# Altium project PPC_notebook_electrical_schematics_v0.6.PrjPcb (part 5 of 10)

## Sheet 16 SATA3 CONTROLLER.SchDoc
size 420 x 297 mm
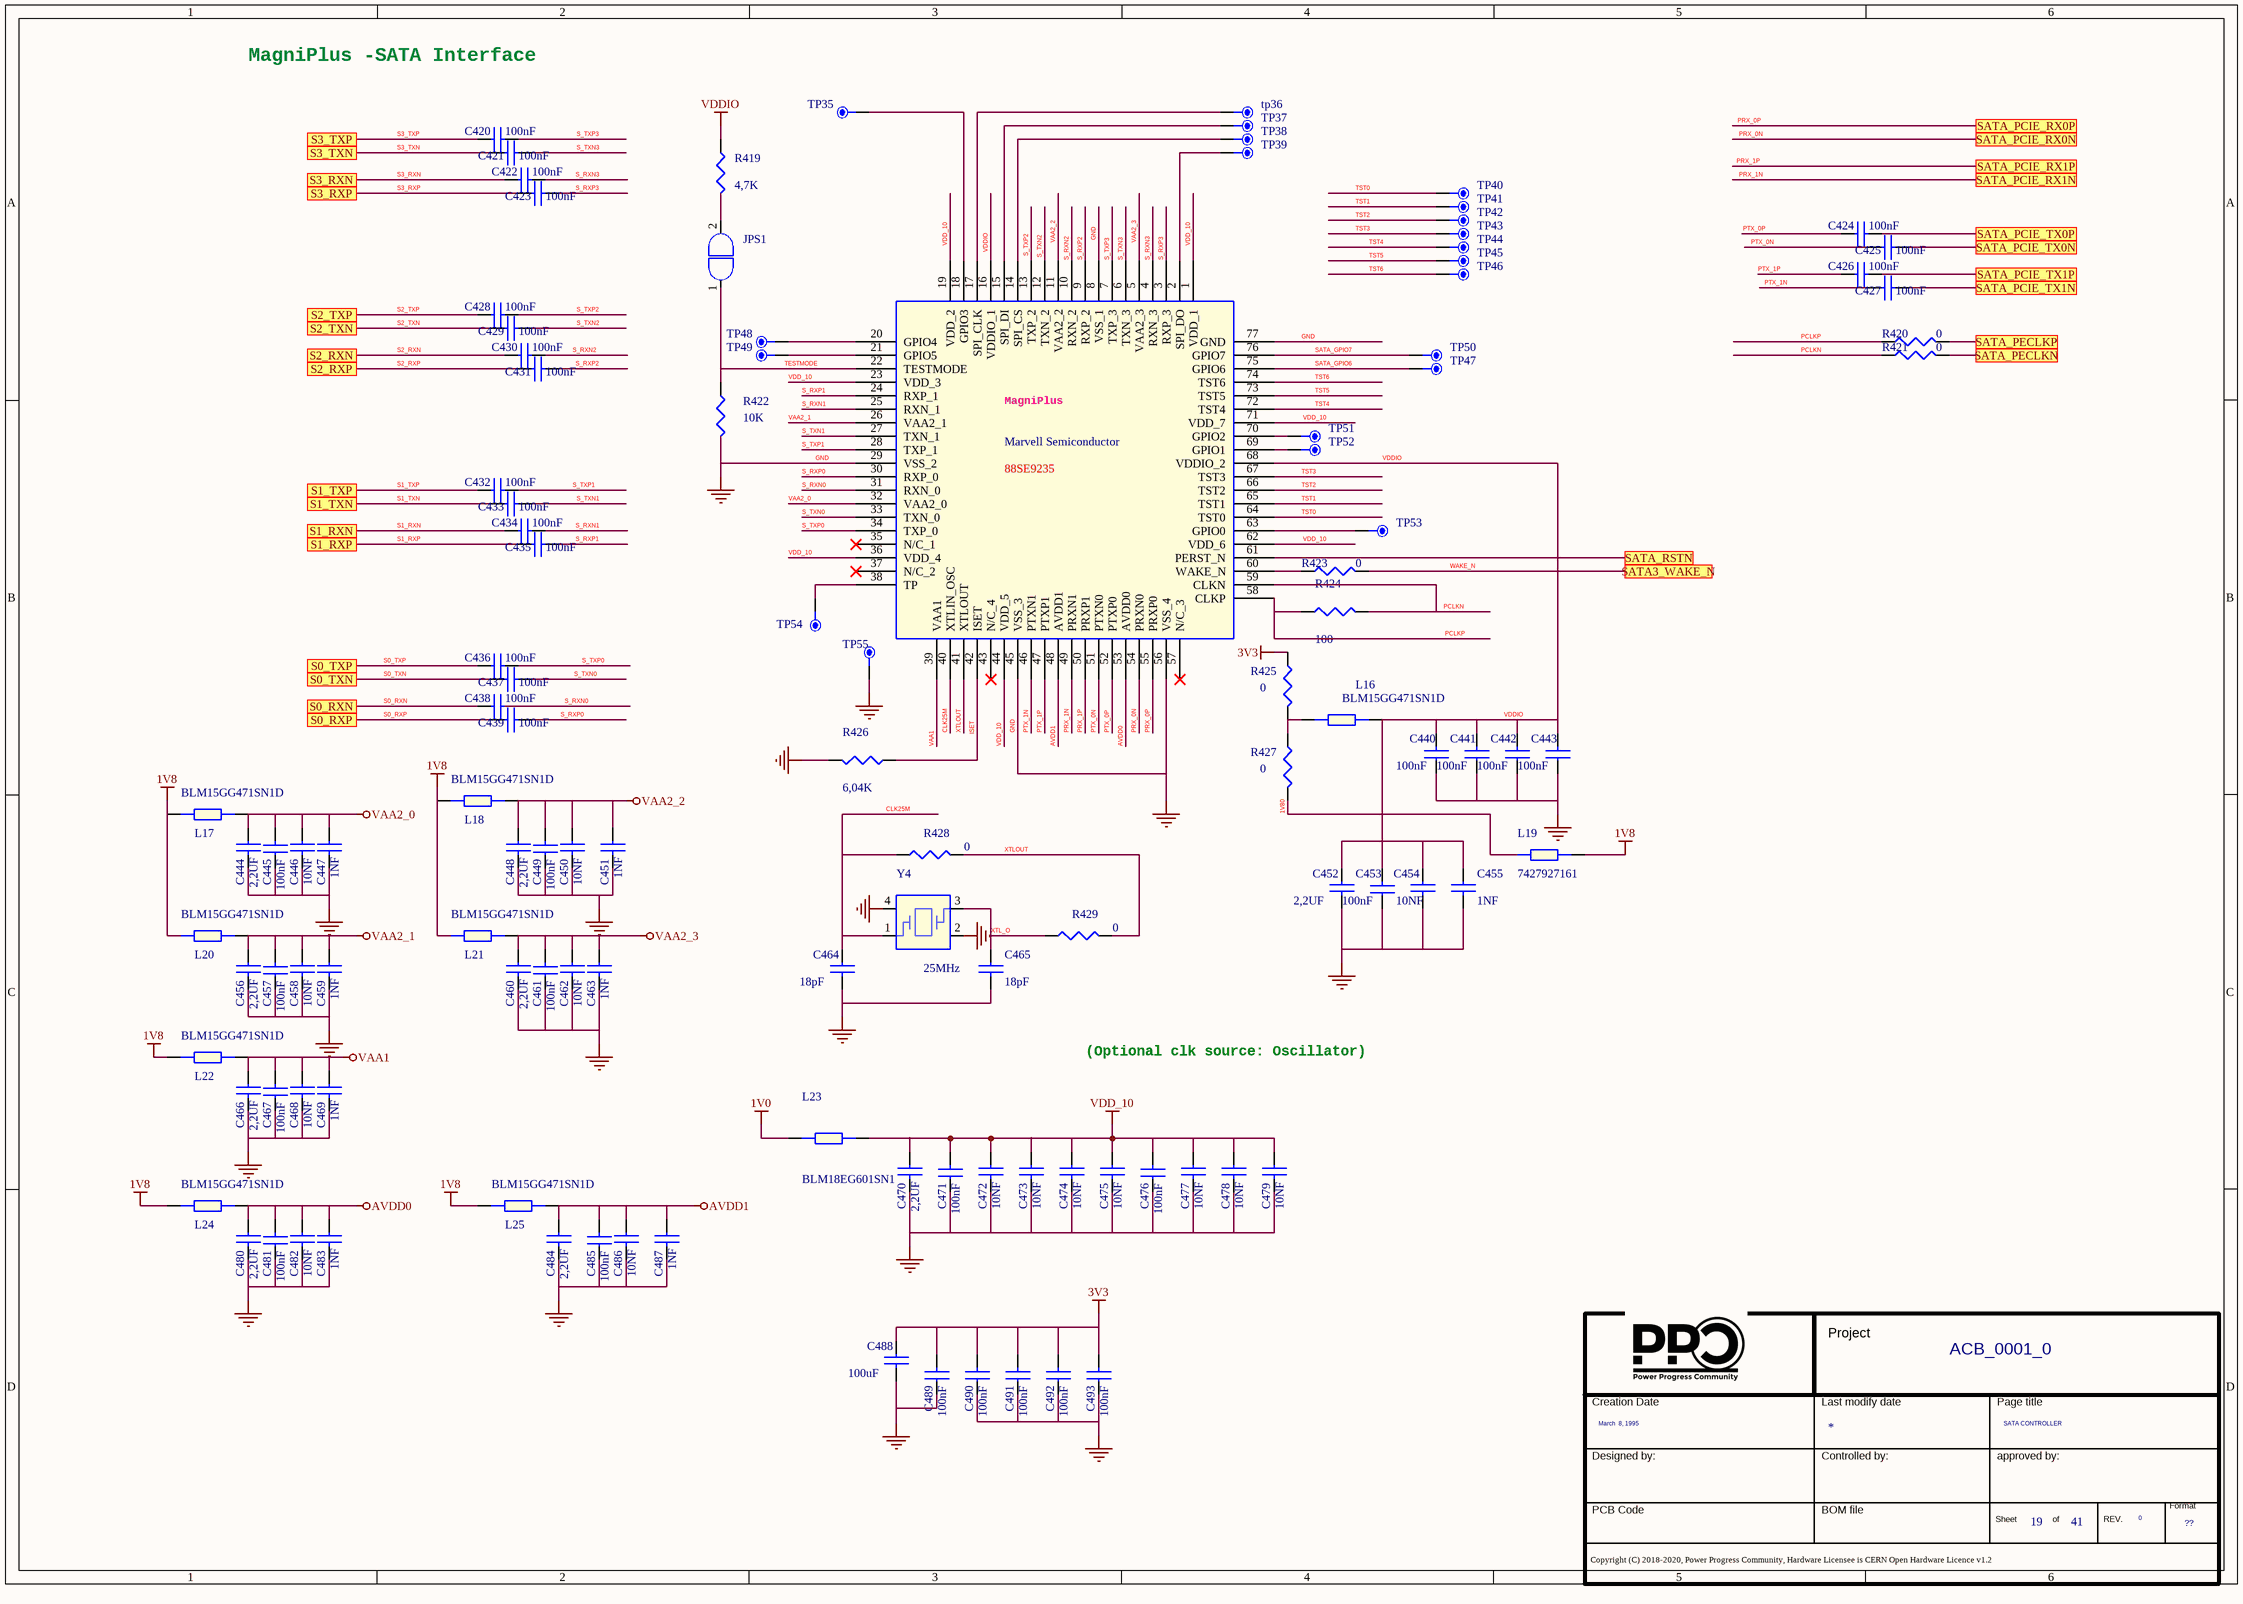
[diagram p32: 16 SATA3 CONTROLLER.SchDoc]

### Parts
(Parts that share a designator on the sheet are numbered #1, #2 ... from top to bottom, then left to right.)
*#22  Page Count: 41  Page Create Date: March  8, 1995  Page Number: 19  Page Size: ??  Page Title: SATA CONTROLLER  RevCode: 0  Title: ACB_0001_0  (hidden comment: Title_block_PPC)  (graphical)
C420  100nF  [SMD_0402]
C421  100nF  [SMD_0402]
C422  100nF  [SMD_0402]
C423  100nF  [SMD_0402]
C424  100nF  [SMD_0402]
C425  100nF  [SMD_0402]
C426  100nF  [SMD_0402]
C427  100nF  [SMD_0402]
C428  100nF  [SMD_0402]
C429  100nF  [SMD_0402]
C430  100nF  [SMD_0402]
C431  100nF  [SMD_0402]
C432  100nF  [SMD_0402]
C433  100nF  [SMD_0402]
C434  100nF  [SMD_0402]
C435  100nF  [SMD_0402]
C436  100nF  [SMD_0402]
C437  100nF  [SMD_0402]
C438  100nF  [SMD_0402]
C439  100nF  [SMD_0402]
C440  100nF  [SMD_0402]
C441  100nF  [SMD_0402]
C442  100nF  [SMD_0402]
C443  100nF  [SMD_0402]
C444  2,2UF  [SMD_0402]
C445  100nF  [SMD_0402]
C446  10NF  [SMD_0402]
C447  1NF  [SMD_0402]
C448  2,2UF  [SMD_0402]
C449  100nF  [SMD_0402]
C450  10NF  [SMD_0402]
C451  1NF  [SMD_0402]
C452  2,2UF  [SMD_0402]
C453  100nF  [SMD_0402]
C454  10NF  [SMD_0402]
C455  1NF  [SMD_0402]
C456  2,2UF  [SMD_0402]
C457  100nF  [SMD_0402]
C458  10NF  [SMD_0402]
C459  1NF  [SMD_0402]
C460  2,2UF  [SMD_0402]
C461  100nF  [SMD_0402]
C462  10NF  [SMD_0402]
C463  1NF  [SMD_0402]
C464  18pF  [SMD_0402]
C465  18pF  [SMD_0402]
C466  2,2UF  [SMD_0402]
C467  100nF  [SMD_0402]
C468  10NF  [SMD_0402]
C469  1NF  [SMD_0402]
C470  2,2UF  [SMD_0402]
C471  100nF  [SMD_0402]
C472  10NF  [SMD_0402]
C473  10NF  [SMD_0402]
C474  10NF  [SMD_0402]
C475  10NF  [SMD_0402]
C476  100nF  [SMD_0402]
C477  10NF  [SMD_0402]
C478  10NF  [SMD_0402]
C479  10NF  [SMD_0402]
C480  2,2UF  [SMD_0402]
C481  100nF  [SMD_0402]
C482  10NF  [SMD_0402]
C483  1NF  [SMD_0402]
C484  2,2UF  [SMD_0402]
C485  100nF  [SMD_0402]
C486  10NF  [SMD_0402]
C487  1NF  [SMD_0402]
C488  100uF  [SMD_0805]
C489  100nF  [SMD_0402]
C490  100nF  [SMD_0402]
C491  100nF  [SMD_0402]
C492  100nF  [SMD_0402]
C493  100nF  [SMD_0402]
JPS1  SOLDER JUMPER X 2  [PCB]  (value not drawn)
L16  BLM15GG471SN1D  [SMD_0402]
L17  BLM15GG471SN1D  [SMD_0402]
L18  BLM15GG471SN1D  [SMD_0402]
L19  7427927161  [SMD_0402]
L20  BLM15GG471SN1D  [SMD_0402]
L21  BLM15GG471SN1D  [SMD_0402]
L22  BLM15GG471SN1D  [SMD_0402]
L23  BLM18EG601SN1  [SMD_0603]
L24  BLM15GG471SN1D  [SMD_0402]
L25  BLM15GG471SN1D  [SMD_0402]
R419  4,7K  [SMD_0402]
R420  0  [SMD_0402]
R421  0  [SMD_0402]
R422  10K  [SMD_0402]
R423  0  [SMD_0402]
R424  100  [SMD_0402]
R425  0  [SMD_0402]
R426  6,04K  [SMD_0603]
R427  0  [SMD_0402]
R428  0  [SMD_0402]
R429  0  [SMD_0402]
TP35  TPS  [TPS]  (value not drawn)
tp36  TPS  [TPS]  (value not drawn)
TP37  TPS  [TPS]  (value not drawn)
TP38  TPS  [TPS]  (value not drawn)
TP39  TPS  [TPS]  (value not drawn)
TP40  TPS  [TPS]  (value not drawn)
TP41  TPS  [TPS]  (value not drawn)
TP42  TPS  [TPS]  (value not drawn)
TP43  TPS  [TPS]  (value not drawn)
TP44  TPS  [TPS]  (value not drawn)
TP45  TPS  [TPS]  (value not drawn)
TP46  TPS  [TPS]  (value not drawn)
TP47  TPS  [TPS]  (value not drawn)
TP48  TPS  [TPS]  (value not drawn)
TP49  TPS  [TPS]  (value not drawn)
TP50  TPS  [TPS]  (value not drawn)
TP51  TPS  [TPS]  (value not drawn)
TP52  TPS  [TPS]  (value not drawn)
TP53  TPS  [TPS]  (value not drawn)
TP54  TPS  [TPS]  (value not drawn)
TP55  TPS  [TPS]  (value not drawn)
U42  Distributor_Part_Number: Marvell Semiconductor  [76-pin QFN 
LBGA-196]  (hidden comment: 88SE9235)
Y4  25MHz  [SMD_5.0x3.2]

### Ports
S0_RXN, S0_RXP, S0_TXN, S0_TXP, S1_RXN, S1_RXP, S1_TXN, S1_TXP, S2_RXN, S2_RXP, S2_TXN, S2_TXP, S3_RXN, S3_RXP, S3_TXN, S3_TXP, SATA3_WAKE_N, SATA_PCIE_RX0N, SATA_PCIE_RX0P, SATA_PCIE_RX1N, SATA_PCIE_RX1P, SATA_PCIE_TX0N, SATA_PCIE_TX0P, SATA_PCIE_TX1N, SATA_PCIE_TX1P, SATA_PECLKN, SATA_PECLKP, SATA_RSTN

### Nets
1V0: L23.1
1V8: L17.1 L18.1 L19.2 L20.1 L21.1 L22.1 L24.1 L25.1
3V3: C488.1 C489.2 C490.2 C491.2 C492.2 C493.2 R425.2
AVDD0: C480.1 C481.2 C482.1 C483.1 L24.2 U42.53(AVDD0)
AVDD1: C484.1 C485.2 C486.1 C487.1 L25.2 U42.48(AVDD1)
GND: C440.1 C441.1 C442.1 C443.1 C444.2 C445.1 C446.2 C447.2 C448.2 C449.1 C450.2 C451.2 C452.2 C453.1 C454.2 C455.2 C456.2 C457.1 C458.2 C459.2 C460.2 C461.1 C462.2 C463.2 C464.2 C465.2 C466.2 C467.1 C468.2 C469.2 C470.2 C471.1 C472.2 C473.2 C474.2 C475.2 C476.1 C477.2 C478.2 C479.2 C480.2 C481.1 C482.2 C483.2 C484.2 C485.1 C486.2 C487.2 C488.2 C489.1 C490.1 C491.1 C492.1 C493.1 R422.2 R426.2 TP55.1 U42.8(VSS_1) U42.29(VSS_2) U42.45(VSS_3) U42.56(VSS_4) U42.77(GND) Y4.2 Y4.4
VAA1: C466.1 C467.2 C468.1 C469.1 L22.2 U42.39(VAA1)
VAA2_0: C444.1 C445.2 C446.1 C447.1 L17.2 U42.32(VAA2_0)
VAA2_1: C456.1 C457.2 C458.1 C459.1 L20.2 U42.26(VAA2_1)
VAA2_2: C448.1 C449.2 C450.1 C451.1 L18.2 U42.11(VAA2_2)
VAA2_3: C460.1 C461.2 C462.1 C463.1 L21.2 U42.5(VAA2_3)
VDD_10: C470.1 C471.2 C472.1 C473.1 C474.1 C475.1 C476.2 C477.1 C478.1 C479.1 L23.2 U42.1(VDD_1) U42.19(VDD_2) U42.23(VDD_3) U42.36(VDD_4) U42.44(VDD_5) U42.62(VDD_6) U42.71(VDD_7)
VDDIO: C440.2 C441.2 C442.2 C443.2 C452.1 C453.2 C454.1 C455.1 L16.1 R419.1 U42.16(VDDIO_1) U42.68(VDDIO_2)
1V80: L19.1 R427.1
CLK25M: C464.1 R428.2 U42.40(XTLIN_OSC) Y4.1
ISET: R426.1 U42.42(ISET)
PCLKN: R421.1 R424.2 U42.59(CLKN)
PCLKP: R420.1 R424.1 U42.58(CLKP)
PRX_0N: U42.54(PRXN0) ; port SATA_PCIE_RX0N
PRX_0P: U42.55(PRXP0) ; port SATA_PCIE_RX0P
PRX_1N: U42.49(PRXN1) ; port SATA_PCIE_RX1N
PRX_1P: U42.50(PRXP1) ; port SATA_PCIE_RX1P
PTX_0N: C425.1 U42.51(PTXN0)
PTX_0P: C424.1 U42.52(PTXP0)
PTX_1N: C427.1 U42.46(PTXN1)
PTX_1P: C426.1 U42.47(PTXP1)
S0_RXN: C438.1 ; port S0_RXN
S0_RXP: C439.1 ; port S0_RXP
S0_TXN: C437.1 ; port S0_TXN
S0_TXP: C436.1 ; port S0_TXP
S1_RXN: C434.1 ; port S1_RXN
S1_RXP: C435.1 ; port S1_RXP
S1_TXN: C433.1 ; port S1_TXN
S1_TXP: C432.1 ; port S1_TXP
S2_RXN: C430.1 ; port S2_RXN
S2_RXP: C431.1 ; port S2_RXP
S2_TXN: C429.1 ; port S2_TXN
S2_TXP: C428.1 ; port S2_TXP
S3_RXN: C422.1 ; port S3_RXN
S3_RXP: C423.1 ; port S3_RXP
S3_TXN: C421.1 ; port S3_TXN
S3_TXP: C420.1 ; port S3_TXP
S_RXN0: C438.2 U42.31(RXN_0)
S_RXN1: C434.2 U42.25(RXN_1)
S_RXN2: C430.2 U42.10(RXN_2)
S_RXN3: C422.2 U42.4(RXN_3)
S_RXP0: C439.2 U42.30(RXP_0)
S_RXP1: C435.2 U42.24(RXP_1)
S_RXP2: C431.2 U42.9(RXP_2)
S_RXP3: C423.2 U42.3(RXP_3)
S_TXN0: C437.2 U42.33(TXN_0)
S_TXN1: C433.2 U42.27(TXN_1)
S_TXN2: C429.2 U42.12(TXN_2)
S_TXN3: C421.2 U42.6(TXN_3)
S_TXP0: C436.2 U42.34(TXP_0)
S_TXP1: C432.2 U42.28(TXP_1)
S_TXP2: C428.2 U42.13(TXP_2)
S_TXP3: C420.2 U42.7(TXP_3)
SATA_GPIO6: TP47.1 U42.75(GPIO6)
SATA_GPIO7: TP50.1 U42.76(GPIO7)
TESTMODE: JPS1.1 R422.1 U42.22(TESTMODE)
TST0: TP40.1 U42.64(TST0)
TST1: TP41.1 U42.65(TST1)
TST2: TP42.1 U42.66(TST2)
TST3: TP43.1 U42.67(TST3)
TST4: TP44.1 U42.72(TST4)
TST5: TP45.1 U42.73(TST5)
TST6: TP46.1 U42.74(TST6)
WAKE_N: R423.2 ; port SATA3_WAKE_N
XTL_O: C465.1 R429.2 Y4.3
XTLOUT: R428.1 R429.1 U42.41(XTLOUT)
NetC109_2: C424.2 ; port SATA_PCIE_TX0P
NetC110_2: C425.2 ; port SATA_PCIE_TX0N
NetC111_2: C426.2 ; port SATA_PCIE_TX1P
NetC112_2: C427.2 ; port SATA_PCIE_TX1N
NetJPS1_2: JPS1.2 R419.2
NetL16_2: L16.2 R425.1 R427.2
NetR286_2: U42.61(PERST_N) ; port SATA_RSTN
NetR420_2: R420.2 ; port SATA_PECLKP
NetR421_2: R421.2 ; port SATA_PECLKN
NetR423_1: R423.1 U42.60(WAKE_N)
NetTP35_1: TP35.1 U42.18(GPIO3)
Nettp36_1: tp36.1 U42.17(SPI_CLK)
NetTP37_1: TP37.1 U42.15(SPI_DI)
NetTP38_1: TP38.1 U42.14(SPI_CS)
NetTP39_1: TP39.1 U42.2(SPI_DO)
NetTP48_1: TP48.1 U42.20(GPIO4)
NetTP49_1: TP49.1 U42.21(GPIO5)
NetTP51_1: TP51.1 U42.70(GPIO2)
NetTP52_1: TP52.1 U42.69(GPIO1)
NetTP53_1: TP53.1 U42.63(GPIO0)
NetTP54_1: TP54.1 U42.38(TP)

Not connected (* = marked no-connect by the designer): U42 35(N/C_1)* 37(N/C_2)* 43(N/C_4)* 57(N/C_3)*

### Notes on the sheet
- MagniPlus -SATA Interface
- (near U42) MagniPlus
- (Optional clk source: Oscillator)

### Library data of the parts
*#22 = Title_block_PPC: Schematic Page Count: 45; Schematic Page Number: 21; Page Modify Date: *
C420 C422 C425 C426 C428 C430 C432 C434 C437 C439 C449 C453 C485 = CAP NP_Dup9: as C495 on sheet 16B Sata Connectors; PCB Footprint: SMD_0402; Distributor 1: MURATA ELETTRONICA SPA; Part Type: Capacitors\Ceramic\SMD\0402
C421 C423 C424 C427 C429 C431 C433 C435 C436 C438 C440-C443 C445 C457 C461 C467 C471 C476 C481 C489-C493 = CAP NP_Dup9: as C498-C500 on sheet 16B Sata Connectors; PCB Footprint: SMD_0402; Part Type: Capacitors\Ceramic\SMD\0402; Distributor 1: MURATA ELETTRONICA SPA
C444 C452 C456 C460 C466 C480 C484 = CAP NP_Dup9: CAP CERAMIC 2.2UF 6.3V X5R 0402; Manufacturer Part Number 1: ECJ-0EB0J225M; Manufacturer 1: Panasonic - ECG; Part Number: PASSIVE_55; RSM: RC0402; PCB Footprint: SMD_0402; Distributor 1: DIGIKEY (PCC2421TR-ND); Part Type: Capacitors\Ceramic\SMD\0402
C446 C458 C462 C468 C472-C475 C477-C479 C482 = CAP NP_Dup9: COND.CER. 10NF 50V 0402 X7R SMD; Manufacturer Part Number 1: C0402C103K5RACTU; Manufacturer 1: KEMET; Part Number: PASSIVE_29; RSM: RC0402; PCB Footprint: SMD_0402; Distributor 1: TTI ITALY SRL; Part Type: Capacitors\Ceramic\SMD\0402
C447 C451 C459 C463 C469 C483 C487 = CAP NP_Dup9: COND.CER. 1NF 50V 0402 NPO SMD; Manufacturer Part Number 1: 223858715523; Manufacturer 1: YAGEO; Part Number: PASSIVE_46; RSM: RC0402; PCB Footprint: SMD_0402; Distributor 1: CLAITRON LASI SILVESTAR S.R.L.; Part Type: Capacitors\Ceramic\SMD\0402
C448 C470 = CAP NP_Dup9: CAP CERAMIC 2.2UF 6.3V X5R 0402; Part Number: PASSIVE_55; Manufacturer 1: Panasonic - ECG; Manufacturer Part Number 1: ECJ-0EB0J225M; RSM: RC0402; PCB Footprint: SMD_0402; Part Type: Capacitors\Ceramic\SMD\0402; Distributor 1: DIGIKEY (PCC2421TR-ND)
C450 C454 C486 = CAP NP_Dup9: COND.CER. 10NF 50V 0402 X7R SMD; Part Number: PASSIVE_29; Manufacturer 1: KEMET; Manufacturer Part Number 1: C0402C103K5RACTU; RSM: RC0402; PCB Footprint: SMD_0402; Part Type: Capacitors\Ceramic\SMD\0402; Distributor 1: TTI ITALY SRL
C455 = CAP NP_Dup9: COND.CER. 1NF 50V 0402 NPO SMD; Part Number: PASSIVE_46; Manufacturer 1: YAGEO; Manufacturer Part Number 1: 223858715523; RSM: RC0402; PCB Footprint: SMD_0402; Part Type: Capacitors\Ceramic\SMD\0402; Distributor 1: CLAITRON LASI SILVESTAR S.R.L.
C464 = CAP NP_Dup9: CAP CER 18PF 50V 5% NP0 0402; Part Number: PASSIVE_43; Manufacturer 1: TDK; Manufacturer Part Number 1: C1005C0G1H180J; RSM: RC0402; PCB Footprint: SMD_0402; Part Type: Capacitors\Ceramic\SMD\0402; Distributor 1: DIGIKEY (445-1238-1-ND)
C465 = CAP NP_Dup9: CAP CER 18PF 50V 5% NP0 0402; Manufacturer Part Number 1: C1005C0G1H180J; Manufacturer 1: TDK; Part Number: PASSIVE_43; RSM: RC0402; PCB Footprint: SMD_0402; Distributor 1: DIGIKEY (445-1238-1-ND); Part Type: Capacitors\Ceramic\SMD\0402
C488 = CAP NP_Dup9: CAP CER 100UF 6.3V 20% X5R 0805; Manufacturer Part Number 1: GRM21BR60J107ME15L; Manufacturer 1: Murata; Part Number: PASSIVE_202; RSM: RC0805; PCB Footprint: SMD_0805; Distributor 1: FARNELL(2494476); Part Type: Capacitors\Ceramic\SMD\0805
JPS1 = SOLDER JUMPER 2x1: SODER JUMPER SU PCB; Part Number: CONNECTORS_335; RSM: JMPS2; PCB Footprint: PCB; Part Type: SOLDER JUMPER
L16 L18 = FERRITE_BEAD_Dup1: FERRITE CHIP 470 OHM 200MA 0402; Manufacturer 1: Murata; Part Number: PASSIVE_371; RSM: RC0402; PCB Footprint: SMD_0402; Distributor 1: DIGIKEY (	490-5198-1-ND); Manufacturer Part Number 1: BLM15GG471SN1D; Part Type: Ferrite Beads\SMD\0402
L17 L20-L22 L24 L25 = FERRITE_BEAD_Dup1: FERRITE CHIP 470 OHM 200MA 0402; Part Number: PASSIVE_371; Manufacturer 1: Murata; RSM: RC0402; PCB Footprint: SMD_0402; Part Type: Ferrite Beads\SMD\0402; Manufacturer Part Number 1: BLM15GG471SN1D; Distributor 1: DIGIKEY (	490-5198-1-ND)
L19 = FERRITE_BEAD: FERRITE BEAD 600R 0.25A 0402; Part Number: PASSIVE_369; Manufacturer 1: WURTH; RSM: RC0402; PCB Footprint: SMD_0402; Part Type: Ferrite Beads\SMD\0402; Manufacturer Part Number 1: 7427927161
L23 = FERRITE_BEAD: FERRITE BEAD 600ohm 500mA 0603 SMD; Part Number: PASSIVE_377; Manufacturer 1: Murata; Manufacturer Part Number 1: BLM18EG601SN1 SMD; RSM: RC0603; Part Type: Ferrite Beads\SMD\0603; PCB Footprint: SMD_0603
R419 = R_Dup8: RESIS.CHIP 4,7K 5% 0402 SMD; Part Number: PASSIVE_861; Manufacturer 1: ROYAL OHM; RSM: RC0402; PCB Footprint: SMD_0402; Part Type: Resistors\Fixed\SMD\0402\5%; Manufacturer Part Number 1: RESIS.CHIP 4,7K 5% 0402 SMD; Distributor 1: CAMEL ELETTRONICA SRL  #
R420 R421 R423 R425 R427-R429 = R_Dup8: as R432 on sheet 16B Sata Connectors; PCB Footprint: SMD_0402; Distributor 1: CAMEL ELETTRONICA SRL  #; Manufacturer Part Number 1: RESIS.CHIP 0R 5% 0402 SMD; Part Type: Resistors\Fixed\SMD\0402\5%
R422 = R_Dup5: as R382 on sheet 14 EC1 PHY; Part Type: Resistors\Fixed\SMD\0402\1%; PCB Footprint: SMD_0402; Manufacturer Part Number 1: RESIS.CHIP 10K 1% 0402 SMD
R424 = R_Dup5: RESIS.CHIP 100R 5% 0402 SMD; Part Number: PASSIVE_812; Manufacturer 1: ROYAL OHM; RSM: RC0402; Part Type: Resistors\Fixed\SMD\0402\5%; PCB Footprint: SMD_0402; Manufacturer Part Number 1: RESIS.CHIP 100R 5% 0402 SMD
R426 = R_Dup5: RESIS.CHIP 6K04 1% 0603 SMD; Part Number: PASSIVE_1047; Manufacturer 1: ROYAL OHM; RSM: RC0603; Part Type: Resistors\Fixed\SMD\0603\1%; PCB Footprint: SMD_0603; Manufacturer Part Number 1: RESIS.CHIP 6K04 1% 0603 SMD
TP35 tp36 TP37-TP55 = TPS_2: Test Point, .025 sq pin; Mfr_Part_Number: Cut From Strip; MFR_Name: Samtec; PCB Footprint: tp36; RSM: AE-TESTPOINT; Distributor_Part_Number: no parts needed
U42 = 2020_34: Two-Lane PCIe 2.0 to Four-Port 6; MFR_Name: Marvell Semi; Mfr_Part_Number: 88SE9230; Part Number: LOGIC_356; Manufacturer 1: MARVELL; RSM: QFN-76-EP_9X9; Display Value: 88SE9235; PCB Footprint: 76-pin QFN / LBGA-196; Distributor: tbd; Part Type: PCIE\SATA; Manufacturer Part Number 1: 88SE9235; Distributor 1: MARVELL(88SE9235A1-NAA2C000)
Y4 = CRYSTAL_4P_Dup2: CRYSTAL 25.000 MHZ 20PF SMD; Part Number: MISC_166; Manufacturer 1: ECS; Manufacturer Part Number 1: ECS-250-20-30B-TR (ROHS COMPLIANT); RSM: XC-CSX2; PCB Footprint: SMD_5.0x3.2; Part Type: Quartz; Distributor 1: DIGIKEY (XC1124CT-ND)

## Sheet 17 USB3 CONTROLLER.SchDoc
size 594 x 420 mm
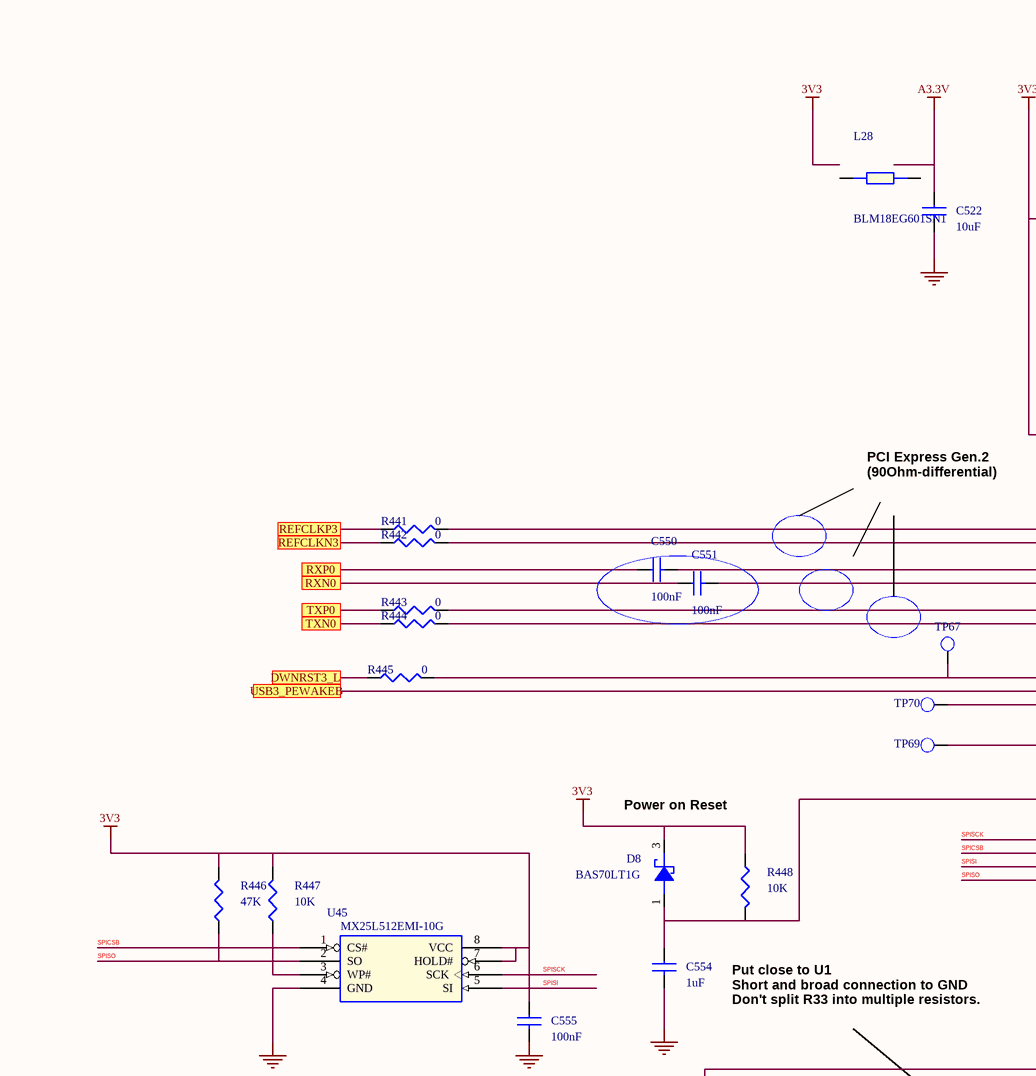
[diagram p33: 17 USB3 CONTROLLER.SchDoc, top left]
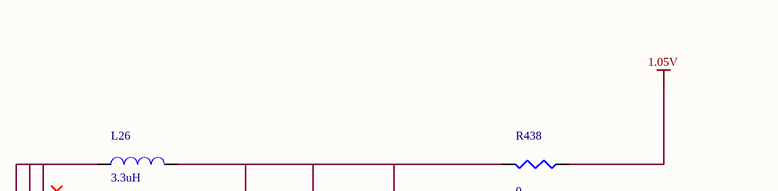
[diagram p34: 17 USB3 CONTROLLER.SchDoc, top right]
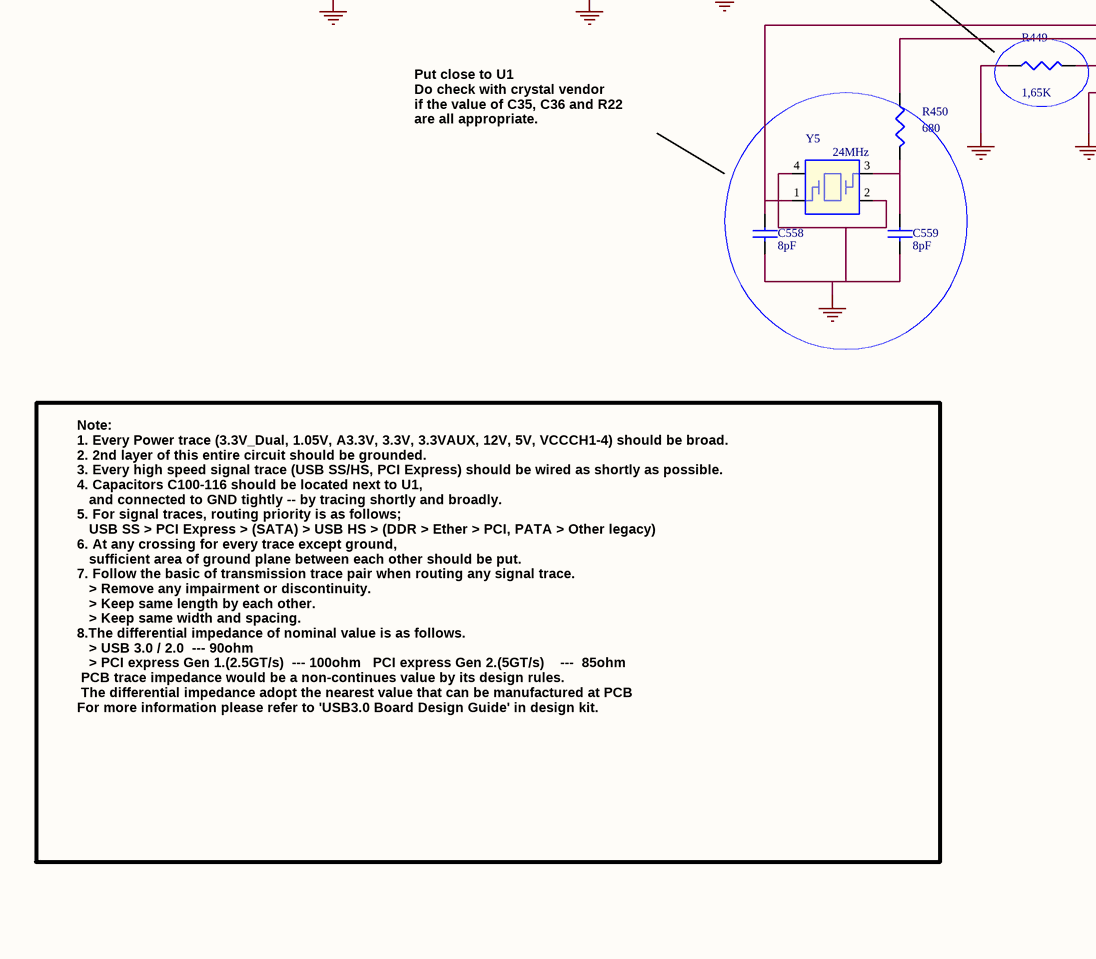
[diagram p35: 17 USB3 CONTROLLER.SchDoc, bottom left]
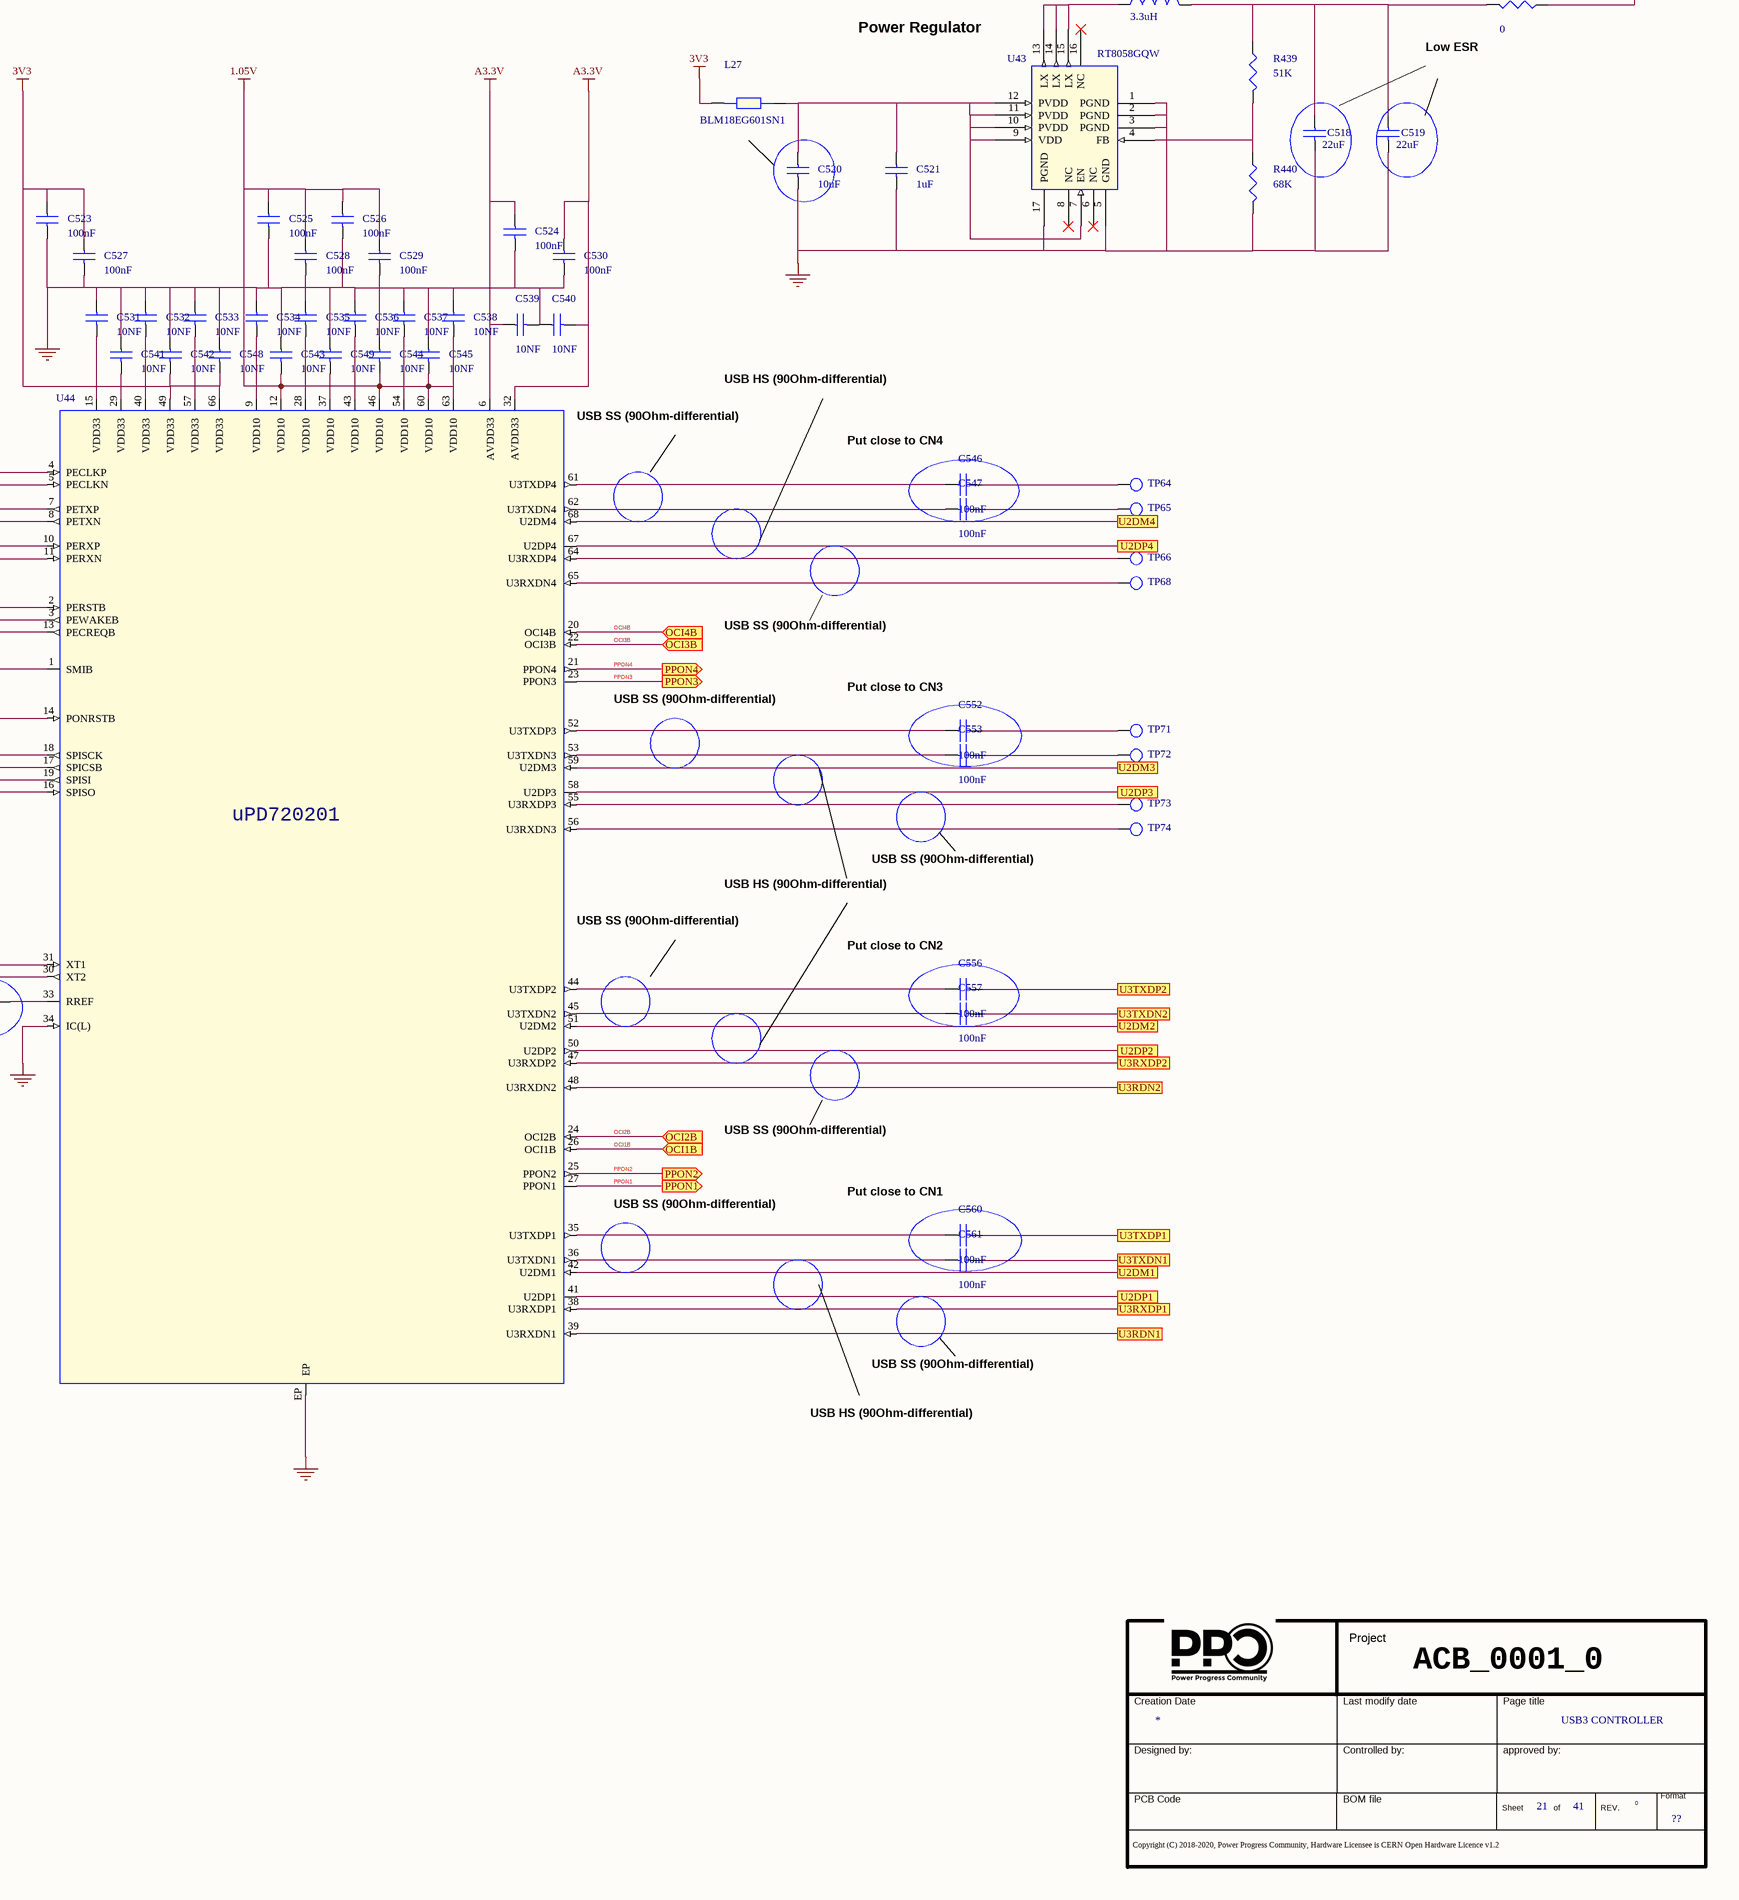
[diagram p36: 17 USB3 CONTROLLER.SchDoc, bottom right]

### Parts
(Parts that share a designator on the sheet are numbered #1, #2 ... from top to bottom, then left to right.)
*#23  Doc: USB3 CONTROLLER  Page Count: 41  Page Number: 21  Page Size: ??  RevCode: 0  (hidden comment: Title_block_PPC)  (graphical)
C518  22uF  [SMD_0805]
C519  22uF  [SMD_0805]
C520  10uF  [SMD_0603]
C521  1uF  [SMD_0402]
C522  10uF  [SMD_0603]
C523  100nF  [SMD_0402]
C524  100nF  [SMD_0402]
C525  100nF  [SMD_0402]
C526  100nF  [SMD_0402]
C527  100nF  [SMD_0402]
C528  100nF  [SMD_0402]
C529  100nF  [SMD_0402]
C530  100nF  [SMD_0402]
C531  10NF  [SMD_0402]
C532  10NF  [SMD_0402]
C533  10NF  [SMD_0402]
C534  10NF  [SMD_0402]
C535  10NF  [SMD_0402]
C536  10NF  [SMD_0402]
C537  10NF  [SMD_0402]
C538  10NF  [SMD_0402]
C539  10NF  [SMD_0402]
C540  10NF  [SMD_0402]
C541  10NF  [SMD_0402]
C542  10NF  [SMD_0402]
C543  10NF  [SMD_0402]
C544  10NF  [SMD_0402]
C545  10NF  [SMD_0402]
C546  100nF  [SMD_0402]
C547  100nF  [SMD_0402]
C548  10NF  [SMD_0402]
C549  10NF  [SMD_0402]
C550  100nF  [SMD_0402]
C551  100nF  [SMD_0402]
C552  100nF  [SMD_0402]
C553  100nF  [SMD_0402]
C554  1uF  [SMD_0402]
C555  100nF  [SMD_0603]
C556  100nF  [SMD_0402]
C557  100nF  [SMD_0402]
C558  8pF  [SMD_0402]
C559  8pF  [SMD_0402]
C560  100nF  [SMD_0402]
C561  100nF  [SMD_0402]
D8  BAS70LT1G  [SOT-23]
L26  3.3uH  [SMD_SRU1028]
L27  BLM18EG601SN1  [SMD_0603]
L28  BLM18EG601SN1  [SMD_0603]
R438  0  [SMD_1206]
R439  51K  [SMD_0402]
R440  68K  [SMD_0402]
R441  0  [SMD_0402]
R442  0  [SMD_0402]
R443  0  [SMD_0402]
R444  0  [SMD_0402]
R445  0  [SMD_0402]
R446  47K  [SMD_0402]
R447  10K  [SMD_0402]
R448  10K  [SMD_0402]
R449  1,65K  [SMD_0402]
R450  680  [SMD_0402]
TP64  TEST POINT  [PCB]  (value not drawn)
TP65  TEST POINT  [PCB]  (value not drawn)
TP66  TEST POINT  [PCB]  (value not drawn)
TP67  TEST POINT  [PCB]  (value not drawn)
TP68  TEST POINT  [PCB]  (value not drawn)
TP69  TEST POINT  [PCB]  (value not drawn)
TP70  TEST POINT  [PCB]  (value not drawn)
TP71  TEST POINT  [PCB]  (value not drawn)
TP72  TEST POINT  [PCB]  (value not drawn)
TP73  TEST POINT  [PCB]  (value not drawn)
TP74  TEST POINT  [PCB]  (value not drawn)
U43  RT8058GQW  [QFN16]
U44  UPD720201K8-701-BAC-A  [QFN_68]  (value not drawn)
U45  MX25L512EMI-10G  [SOP-8]
Y5  24MHz  [SMD_2.5x3.2]

### Ports
DWNRST3_L, OCI1B (in), OCI2B (in), OCI3B (in), OCI4B (in), PPON1 (out), PPON2 (out), PPON3 (out), PPON4 (out), REFCLKN3, REFCLKP3, RXN0, RXP0, TXN0, TXP0, U2DM1, U2DM2, U2DM3, U2DM4, U2DP1, U2DP2, U2DP3, U2DP4, U3RDN1, U3RDN2, U3RXDP1, U3RXDP2, U3TXDN1, U3TXDN2, U3TXDP1, U3TXDP2, USB3_PEWAKEB

### Nets
1.05V: C525.1 C526.1 C528.1 C529.1 C534.2 C535.2 C536.2 C537.2 C538.2 C543.2 C544.2 C545.2 C549.2 R438.2 U44.9(VDD10) U44.12(VDD10) U44.28(VDD10) U44.37(VDD10) U44.43(VDD10) U44.46(VDD10) U44.54(VDD10) U44.60(VDD10) U44.63(VDD10)
3V3: C523.1 C527.1 C531.2 C532.2 C533.2 C541.2 C542.2 C548.2 C555.1 D8.3(CATHODE) L27.1 R446.2 R447.2 R448.1 U44.15(VDD33) U44.29(VDD33) U44.40(VDD33) U44.49(VDD33) U44.57(VDD33) U44.66(VDD33) U45.7(HOLD#) U45.8(VCC)
A3.3V: C522.1 C524.1 C530.1 C539.1 C540.2 U44.6(AVDD33) U44.32(AVDD33)
GND: C518.2 C519.2 C520.2 C521.2 C522.2 C523.2 C524.2 C525.2 C526.2 C527.2 C528.2 C529.2 C530.2 C531.1 C532.1 C533.1 C534.1 C535.1 C536.1 C537.1 C538.1 C539.2 C540.1 C541.1 C542.1 C543.1 C544.1 C545.1 C548.1 C549.1 C554.2 C555.2 C558.2 C559.2 R440.1 R449.2 U43.1(PGND) U43.2(PGND) U43.3(PGND) U43.5(GND) U43.17(PGND) U44.34(IC(L)) U44.EP U45.4(GND) Y5.2 Y5.4
DWNRST3_L: R445.1 ; port DWNRST3_L
OCI1B: U44.26(OCI1B) ; port OCI1B
OCI2B: U44.24(OCI2B) ; port OCI2B
OCI3B: U44.22(OCI3B) ; port OCI3B
OCI4B: U44.20(OCI4B) ; port OCI4B
PPON1: U44.27(PPON1) ; port PPON1
PPON2: U44.25(PPON2) ; port PPON2
PPON3: U44.23(PPON3) ; port PPON3
PPON4: U44.21(PPON4) ; port PPON4
RXN0: C551.1 ; port RXN0
RXP0: C550.1 ; port RXP0
SPICSB: U44.17(SPICSB) U45.1(CS#)
SPISCK: U44.18(SPISCK) U45.6(SCK)
SPISI: U44.19(SPISI) U45.5(SI)
SPISO: R446.1 U44.16(SPISO) U45.2(SO)
TXN0: R444.1 ; port TXN0
TXP0: R443.1 ; port TXP0
NetC518_1: C518.1 C519.1 L26.2 R438.1 R439.2
NetC520_1: C520.1 C521.1 L27.2 U43.7(EN) U43.9(VDD) U43.10(PVDD) U43.11(PVDD) U43.12(PVDD)
NetC546_1: C546.1 U44.61(U3TXDP4)
NetC546_2: C546.2 TP64.1(TP)
NetC547_1: C547.1 U44.62(U3TXDN4)
NetC547_2: C547.2 TP65.1(TP)
NetC550_2: C550.2 U44.7(PETXP)
NetC551_2: C551.2 U44.8(PETXN)
NetC552_1: C552.1 U44.52(U3TXDP3)
NetC552_2: C552.2 TP71.1(TP)
NetC553_1: C553.1 U44.53(U3TXDN3)
NetC553_2: C553.2 TP72.1(TP)
NetC554_1: C554.1 D8.1(ANODE) R448.2 U44.14(PONRSTB)
NetC556_1: C556.1 U44.44(U3TXDP2)
NetC556_2: C556.2 ; port U3TXDP2
NetC557_1: C557.1 U44.45(U3TXDN2)
NetC557_2: C557.2 ; port U3TXDN2
NetC558_1: C558.1 U44.31(XT1) Y5.1
NetC559_1: C559.1 R450.1 Y5.3
NetC560_1: C560.1 U44.35(U3TXDP1)
NetC560_2: C560.2 ; port U3TXDP1
NetC561_1: C561.1 U44.36(U3TXDN1)
NetC561_2: C561.2 ; port U3TXDN1
NetFL4_1: U44.51(U2DM2) ; port U2DM2
NetFL4_4: U44.50(U2DP2) ; port U2DP2
NetFL5_1: U44.47(U3RXDP2) ; port U3RXDP2
NetFL5_4: U44.48(U3RXDN2) ; port U3RDN2
NetFL7_1: U44.42(U2DM1) ; port U2DM1
NetFL7_4: U44.41(U2DP1) ; port U2DP1
NetFL8_1: U44.38(U3RXDP1) ; port U3RXDP1
NetFL8_4: U44.39(U3RXDN1) ; port U3RDN1
NetFL9_1: U44.68(U2DM4) ; port U2DM4
NetFL9_4: U44.67(U2DP4) ; port U2DP4
NetFL11_1: U44.59(U2DM3) ; port U2DM3
NetFL11_4: U44.58(U2DP3) ; port U2DP3
NetL26_1: L26.1 U43.13(LX) U43.14(LX) U43.15(LX)
NetR294_2: U44.3(PEWAKEB) ; port USB3_PEWAKEB
NetR439_1: R439.1 R440.2 U43.4(FB)
NetR441_1: R441.1 ; port REFCLKP3
NetR441_2: R441.2 U44.4(PECLKP)
NetR442_1: R442.1 ; port REFCLKN3
NetR442_2: R442.2 U44.5(PECLKN)
NetR443_2: R443.2 U44.10(PERXP)
NetR444_2: R444.2 U44.11(PERXN)
NetR445_2: R445.2 TP67.1(TP) U44.2(PERSTB)
NetR447_1: R447.1 U45.3(WP#)
NetR449_1: R449.1 U44.33(RREF)
NetR450_2: R450.2 U44.30(XT2)
NetTP66_1: TP66.1(TP) U44.64(U3RXDP4)
NetTP68_1: TP68.1(TP) U44.65(U3RXDN4)
NetTP69_1: TP69.1(TP) U44.1(SMIB)
NetTP70_1: TP70.1(TP) U44.13(PECREQB)
NetTP73_1: TP73.1(TP) U44.55(U3RXDP3)
NetTP74_1: TP74.1(TP) U44.56(U3RXDN3)

Not connected (* = marked no-connect by the designer): L28 1 2; U43 6(NC)* 8(NC)* 16(NC)*

### Notes on the sheet
- Power Regulator
- (near R438) Low ESR
- (near U44) PCI Express Gen.2
  (90Ohm-differential)
- (near U44) USB SS (90Ohm-differential)
- USB HS (90Ohm-differential)
- (near C546) Put close to CN4
- USB SS (90Ohm-differential)
- Power on Reset
- (near C552) Put close to CN3
- (near U44) Put close to U1
  Short and broad connection to GND
  Don't split R33 into multiple resistors.
- (near C556) Put close to CN2
- Put close to U1
  Do check with crystal vendor
  if the value of C35, C36 and R22
  are all appropriate.
- (near C560) Put close to CN1
- Note:
  1. Every Power trace (3.3V_Dual, 1.05V, A3.3V, 3.3V, 3.3VAUX, 12V, 5V, VCCCH1-4) should be broad.
  2. 2nd layer of this entire circuit should be grounded.
  3. Every high speed signal trace (USB SS/HS, PCI Express) should be wired as shortly as possible.
  4. Capacitors C100-116 should be located next to U1,
  and connected to GND tightly -- by tracing shortly and broadly.
  5. For signal traces, routing priority is as follows;
  USB SS > PCI Express > (SATA) > USB HS > (DDR > Ether > PCI, PATA > Other legacy)
  6. At any crossing for every trace except ground,
  sufficient area of ground plane between each other should be put.
  7. Follow the basic of transmission trace pair when routing any signal trace.
  > Remove any impairment or discontinuity.
  > Keep same length by each other.
  > Keep same width and spacing.
  8.The differential impedance of nominal value is as follows.
  > USB 3.0 / 2.0  --- 90ohm
  > PCI express Gen 1.(2.5GT/s)  --- 100ohm   PCI express Gen 2.(5GT/s)    ---  85ohm
  PCB trace impedance would be a non-continues value by its design rules.
  The differential impedance adopt the nearest value that can be manufactured at PCB
  For more information please refer to 'USB3.0 Board Design Guide' in design kit.
- ACB_0001_0
- (in symbol uPD720171_0) uPD720201

### Library data of the parts
*#23 = Title_block_PPC: Title: T2080PCIe; Schematic Page Count: 45; Schematic Page Number: 23; Author: MICETEK; Page Create Date: March  8, 1995; Page Title: ?; Page Modify Date: *
C518 C519 = CAP NP_Dup6: 22UF 35V 20% 0805; Manufacturer Part Number 1: C2012X5R1V226M125AC; Manufacturer 1: TDK; Part Number: PASSIVE_224; RSM: RC0805; PCB Footprint: SMD_0805; Part Type: Capacitors\Ceramic\SMD\0805
C520 = CAP NP_Dup2: COND.CER.10uF 0603 25V SMD; Manufacturer Part Number 1: CL10A106MA8NRNC; Manufacturer 1: SAMSUNG; Part Number: PASSIVE_124; RSM: RC0603; PCB Footprint: SMD_0603; Part Type: Capacitors\Ceramic\SMD\0603
C521 C554 = CAP NP_Dup2: CAP CER 1UF 25V X6S 0402; Manufacturer Part Number 1: GRM155C81E105KE11D; Manufacturer 1: Murata; Part Number: PASSIVE_1446; RSM: RC0402; PCB Footprint: SMD_0402; Part Type: Capacitors\Ceramic\SMD\0402
C522 = CAP NP_Dup2: COND.CER.10uF 0603 25V SMD; Part Number: PASSIVE_124; Manufacturer 1: SAMSUNG; Manufacturer Part Number 1: CL10A106MA8NRNC; RSM: RC0603; Part Type: Capacitors\Ceramic\SMD\0603; PCB Footprint: SMD_0603
C523-C530 C546 C547 C550-C553 C556 C557 C560 C561 = CAP NP_Dup2: COND.CER. 100NF 50V 0402 X7R SMD; Part Number: PASSIVE_24; Manufacturer 1: TDK; Manufacturer Part Number 1: CGA2B3X7R1H104M050BD; RSM: RC0402; Part Type: Capacitors\Ceramic\SMD\0402; PCB Footprint: SMD_0402
C531-C545 C548 C549 = CAP NP_Dup2: COND.CER. 10NF 50V 0402 X7R SMD; Manufacturer Part Number 1: C0402C103K5RACTU; Manufacturer 1: KEMET; Part Number: PASSIVE_29; RSM: RC0402; PCB Footprint: SMD_0402; Part Type: Capacitors\Ceramic\SMD\0402
C555 = CAP NP_Dup2: COND.CER.100NF 50V 0603 X7R SMD; Part Number: PASSIVE_118; Manufacturer 1: PANASONIC; Manufacturer Part Number 1: ECJ1VB1H104K; RSM: RC0603; Part Type: Capacitors\Ceramic\SMD\0603; PCB Footprint: SMD_0603
C558 C559 = CAP NP_Dup7: CAP CER 8PF 50V C0G/NPO 0402; Part Number: PASSIVE_1461; Manufacturer 1: YAGEO; Manufacturer Part Number 1: CC0402DRNPO9BN8R0; RSM: RC0402; Part Type: Capacitors\Ceramic\SMD\0402; PCB Footprint: SMD_0402
D8 = diode_schottky_SOT23: DIODE SCHOTTKY 70V SOT23; Manufacturer 1: ON_SEMI; Part Number: DISCRETE_83; PCB Footprint: SOT-23; Distributor 1: DIGIKEY (BAS70LT1GOSCT-ND); Manufacturer Part Number 1: BAS70LT1G; Part Type: Diodes\SCHOTTKY; RSM: SOT-23
L26 = INDUCTOR_Dup1: INDUCTOR SHIELD PWR 3.3UH SMD; Manufacturer Part Number 1: SRU1028-3R3Y; Manufacturer 1: BOURNS INC.; Part Number: PASSIVE_533; RSM: IND-BOURNS-SRU1028; PCB Footprint: SMD_SRU1028; Part Type: Inductors\SMD\SRU1028
L27 L28 = FERRITE_BEAD: as L23 on sheet 16 SATA3 CONTROLLER; Part Type: Ferrite Beads\SMD\0603; PCB Footprint: SMD_0603
R438 = R_Dup5: RESIS. 0R 1/4W 1206 SMD E96; Manufacturer Part Number 1: RC1206JR-070RL; Manufacturer 1: YAGEO; Part Number: PASSIVE_1266; RSM: RC1206; PCB Footprint: SMD_1206; Part Type: Resistors\Fixed\SMD\1206\5%
R439 = R_Dup5: RESIS.CHIP 51K 1% 0402 SMD; Manufacturer 1: ROYAL OHM; Part Number: PASSIVE_752; RSM: RC0402; Manufacturer Part Number 1: RESIS.CHIP 51K 1% 0402 SMD; PCB Footprint: SMD_0402; Part Type: Resistors\Fixed\SMD\0402\1%
R440 = R_Dup5: RESIS.CHIP 68K 1% 0402 SMD; Part Number: PASSIVE_1435; Manufacturer 1: ROYAL OHM; Manufacturer Part Number 1: RESIS.68K 1% 0402 SMD; RSM: RC0402; Part Type: Resistors\Fixed\SMD\0402\1%; PCB Footprint: SMD_0402
R441-R445 = R_Dup5: RESIS.CHIP 0R 5% 0402 SMD; Part Number: PASSIVE_805; Manufacturer 1: ROYAL OHM; RSM: RC0402; Part Type: Resistors\Fixed\SMD\0402\5%; Manufacturer Part Number 1: RESIS.CHIP 0R 5% 0402 SMD; Distributor 1: CAMEL ELETTRONICA SRL  #; PCB Footprint: SMD_0402
R446 = R_Dup5: RESIS.CHIP 47K 1% 0402 SMD; Part Number: PASSIVE_737; Manufacturer 1: ROYAL OHM; RSM: RC0402; Part Type: Resistors\Fixed\SMD\0402\1%; PCB Footprint: SMD_0402; Manufacturer Part Number 1: RESIS.CHIP 47K 1% 0402 SMD
R447 R448 = R_Dup5: RESIS.CHIP 10K 1% 0402 SMD; Manufacturer 1: ROYAL OHM; Part Number: PASSIVE_584; RSM: RC0402; Manufacturer Part Number 1: RESIS.CHIP 10K 1% 0402 SMD; PCB Footprint: SMD_0402; Part Type: Resistors\Fixed\SMD\0402\1%
R449 = R_Dup5: RESIS.CHIP 1K65 1% 0402 SMD; Part Number: PASSIVE_576; Manufacturer 1: PANASONIC; Manufacturer Part Number 1: ERJ-2RKF1651X; RSM: RC0402; Part Type: Resistors\Fixed\SMD\0402\1%; PCB Footprint: SMD_0402
R450 = R_Dup5: RES SMD 680 OHM 1% 1/16W 0402; Part Number: PASSIVE_774; Manufacturer 1: YAGEO; Manufacturer Part Number 1: RC0402FR-07680RL; RSM: RC0402; Part Type: Resistors\Fixed\SMD\0402\1%; PCB Footprint: SMD_0402
TP64-TP74 = T POINT R_Dup1: as TP56-TP63 on sheet 16B Sata Connectors; PCB Footprint: PCB; Part Type: Tpoint
U43 = RT8058PQW_1: IC REG BUCK ADJUSTABLE 2A 16WQFN; Part Number: LINEAR_327; Manufacturer 1: Richtek; RSM: QFN-16-3X3-EP; PCB Footprint: QFN16; Part Type: Regulators\Switching; Manufacturer Part Number 1: RT8058GQW; Distributor 1: DIGIKEY (1028-1000-1-ND)
U44 = uPD720171_0: Speed Host Controller USB 3.0 3.3V; Part Number: LOGIC_352; Manufacturer 1: RENESAS; RSM: QFN-68-EP_8X8; PCB Footprint: QFN_68; Part Type: PCIE\PCIE_USB3; Manufacturer Part Number 1: UPD720201K8-701-BAC-A; Distributor 1: ARROW(UPD720201K8-701-BAC-A)
U45 = AT25640_1: IC FLASH 512K SPI 104MHZ 8SOP; Part Number: MEMORIES_104; Manufacturer 1: MACRONIX; Part Type: FLASH; PCB Footprint: SOP-8; Manufacturer Part Number 1: MX25L512EMI-10G; Distributor 1: DIGIKEY(1092-1110-ND); RSM: SOP-8
Y5 = CRYSTAL_4P: CRYSTAL 24MHZ 10PF SMD; Manufacturer Part Number 1: 403C11A24M00000; Manufacturer 1: CTS; Part Number: MISC_160; RSM: XC-CTS-632; PCB Footprint: SMD_2.5x3.2; Distributor 1: DIGIKEY(CTX849CT-ND); Part Type: Quartz

## Sheet 18B_ETHERNET CARD.SchDoc
size 297 x 209 mm
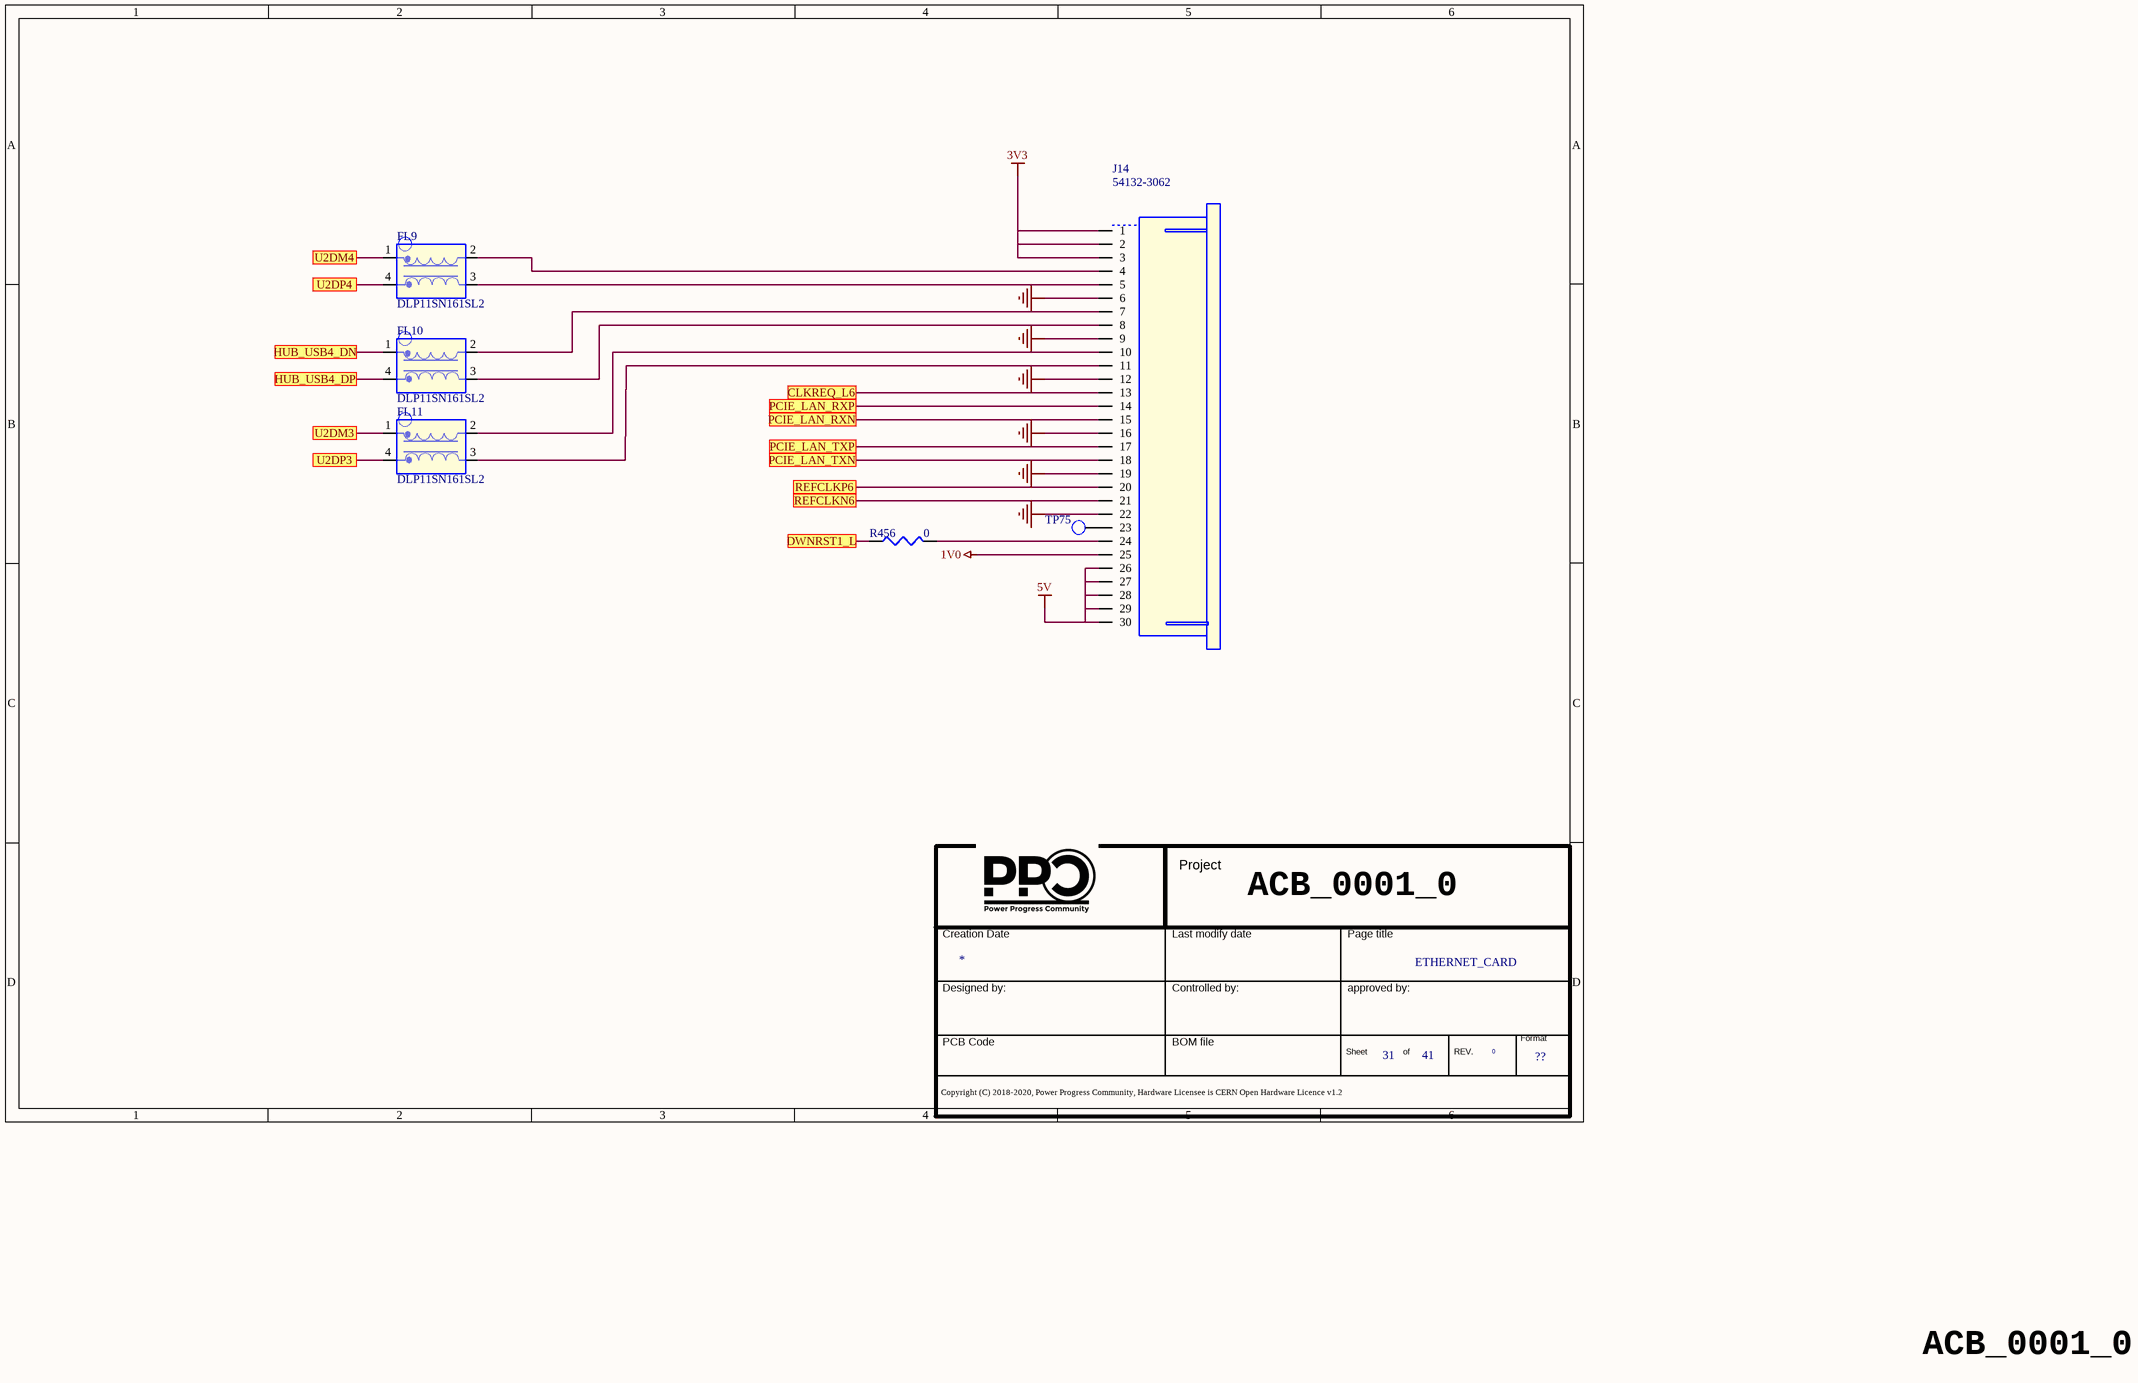
[diagram p37: 18B_ETHERNET CARD.SchDoc]

### Parts
(Parts that share a designator on the sheet are numbered #1, #2 ... from top to bottom, then left to right.)
*#24  Doc: ETHERNET_CARD  Page Count: 41  Page Number: 31  Page Size: ??  RevCode: 0  (hidden comment: Title_block_PPC)  (graphical)
FL9  DLP11SN161SL2  [SMD]
FL10  DLP11SN161SL2  [SMD]
FL11  DLP11SN161SL2  [SMD]
J14  54132-3062  [30 PIN PASSO 0.5mm]
R456  0  [SMD_0402]
TP75  TEST POINT  [PCB]  (value not drawn)

### Ports
CLKREQ_L6, DWNRST1_L, HUB_USB4_DN, HUB_USB4_DP, PCIE_LAN_RXN, PCIE_LAN_RXP, PCIE_LAN_TXN, PCIE_LAN_TXP, REFCLKN6, REFCLKP6, U2DM3, U2DM4, U2DP3, U2DP4

### Nets
1V0: J14.25
3V3: J14.1 J14.2 J14.3
5V: J14.26 J14.27 J14.28 J14.29 J14.30
GND: J14.6 J14.9 J14.12 J14.16 J14.19 J14.22
CLKREQ_L6: J14.13 ; port CLKREQ_L6
DWNRST1_L: R456.1 ; port DWNRST1_L
NetC568_2: J14.14 ; port PCIE_LAN_RXP
NetC570_2: J14.15 ; port PCIE_LAN_RXN
NetFL9_1: FL9.1 ; port U2DM4
NetFL9_2: FL9.2 J14.4
NetFL9_3: FL9.3 J14.5
NetFL9_4: FL9.4 ; port U2DP4
NetFL10_1: FL10.1 ; port HUB_USB4_DN
NetFL10_2: FL10.2 J14.7
NetFL10_3: FL10.3 J14.8
NetFL10_4: FL10.4 ; port HUB_USB4_DP
NetFL11_1: FL11.1 ; port U2DM3
NetFL11_2: FL11.2 J14.10
NetFL11_3: FL11.3 J14.11
NetFL11_4: FL11.4 ; port U2DP3
NetJ14_17: J14.17 ; port PCIE_LAN_TXP
NetJ14_18: J14.18 ; port PCIE_LAN_TXN
NetJ14_20: J14.20 ; port REFCLKP6
NetJ14_21: J14.21 ; port REFCLKN6
NetJ14_23: J14.23 TP75.1(TP)
NetJ14_24: J14.24 R456.2

### Notes on the sheet
- ACB_0001_0

### Library data of the parts
*#24 = Title_block_PPC: Title: T2080PCIe; Schematic Page Count: 45; Schematic Page Number: 25; Author: MICETEK; Page Create Date: March  8, 1995; Page Title: ?; Page Modify Date: *
FL9 FL11 = USB_CHOKE: CHOKE COMMON MODE 90 OHM 0805; Manufacturer Part Number 1: DLW21HN900SQ2L; Manufacturer 1: Murata; Part Number: PASSIVE_1366; RSM: EMI-DLW21; Distributor 1: DIGIKEY(490-1064-1-ND); Part Type: FILTER; PCB Footprint: SMD
FL10 = USB_CHOKE: CHOKE COMMON MODE 90 OHM 0805; Part Number: PASSIVE_1366; Manufacturer 1: Murata; Manufacturer Part Number 1: DLW21HN900SQ2L; RSM: EMI-DLW21; Part Type: FILTER; Distributor 1: DIGIKEY(490-1064-1-ND); PCB Footprint: SMD
J14 = ZIF_30: CONN FPC/FFC .50mm 30 pos bot contact; Part Number: CONNECTORS_593; DEV: JFS_54132ZIF40P_01; DESIG: FPC CONNECTOR ZIP; REF: 54132-4097; BOI: 40 pins; FAB: MOLEX; RSM: MOLEX-54132-060-30; VAL: 54132-4097; PCB Footprint: 30 PIN PASSO 0.5mm; Distributor 1: MOUSER(538-54132-3062); Manufacturer Part Number 1: 54132-3062; Manufacturer 1: MOLEX; Part Type: ZIF
R456 = R_Dup5: RESIS.CHIP 0R 5% 0402 SMD; Manufacturer 1: ROYAL OHM; Part Number: PASSIVE_805; RSM: RC0402; Manufacturer Part Number 1: RESIS.CHIP 0R 5% 0402 SMD; Part Type: Resistors\Fixed\SMD\0402\5%; PCB Footprint: SMD_0402
TP75 = T POINT R: TEST POINT SU PCB; Part Number: CONNECTORS_542; RSM: AE-TESTPOINT; Part Type: Tpoint; PCB Footprint: PCB

## Sheet 18 USB3_ports.SchDoc
size 420 x 297 mm
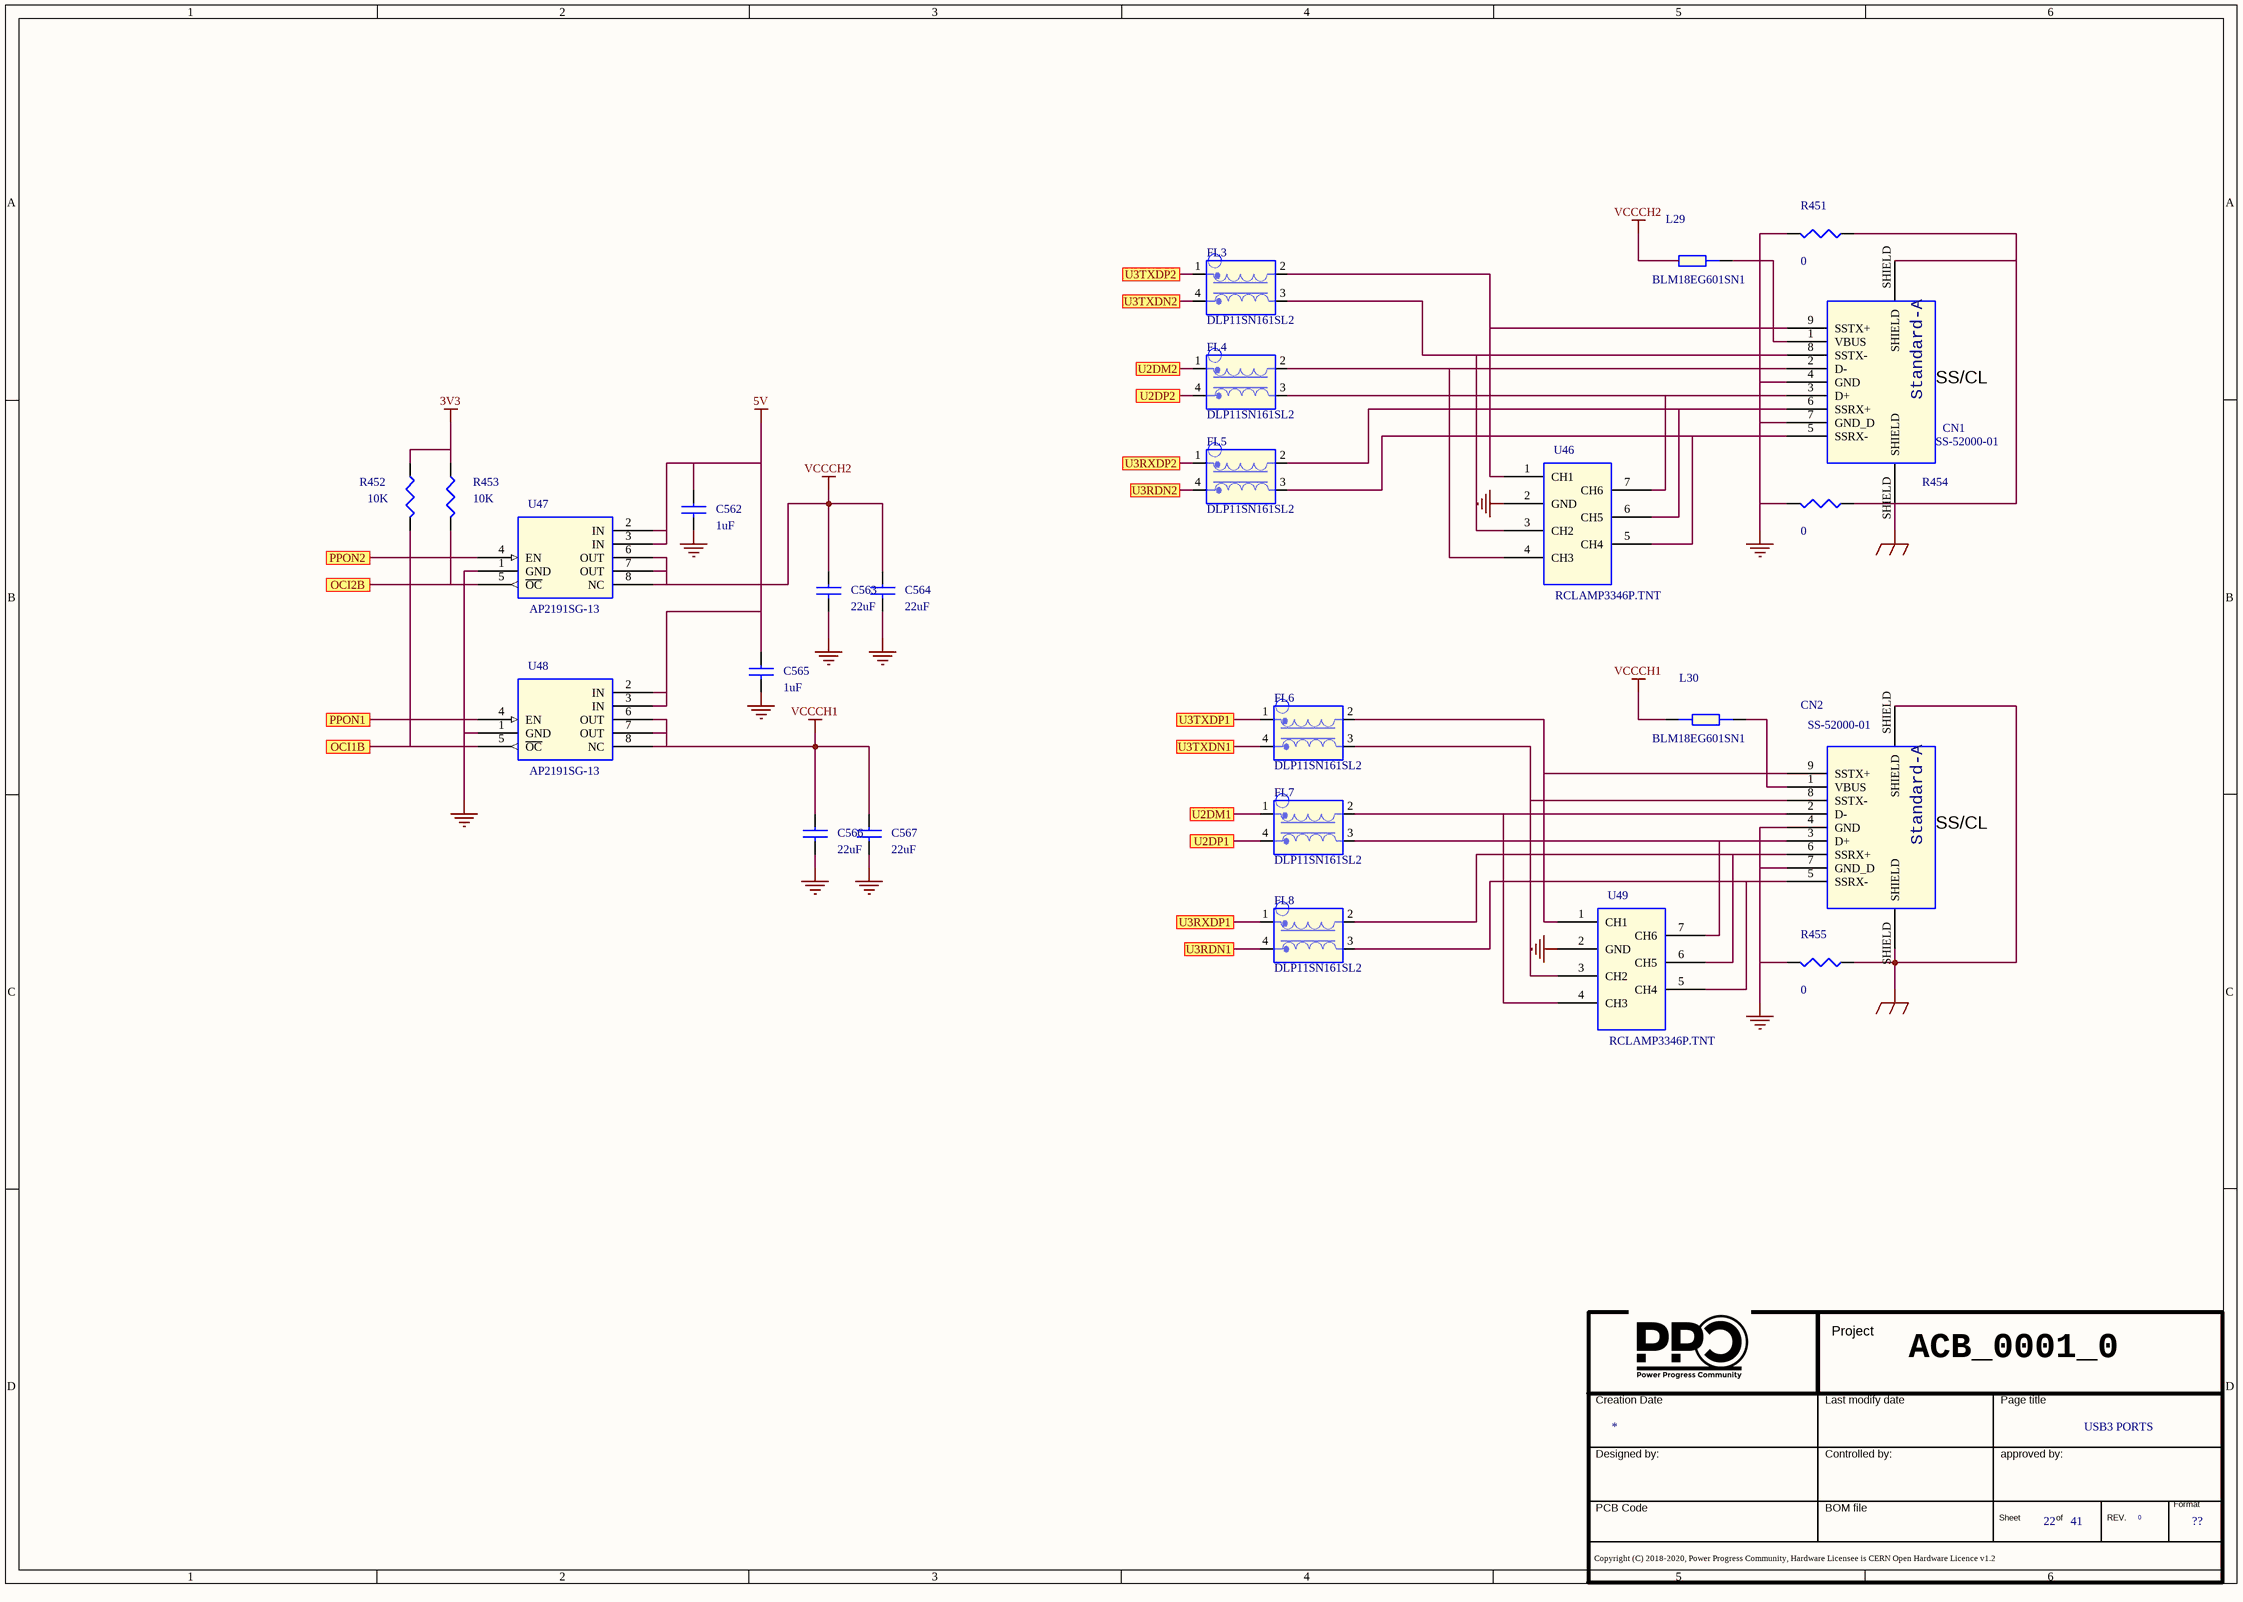
[diagram p38: 18 USB3_ports.SchDoc]

### Parts
(Parts that share a designator on the sheet are numbered #1, #2 ... from top to bottom, then left to right.)
*#25  Doc: USB3 PORTS  Page Count: 41  Page Number: 22  Page Size: ??  RevCode: 0  (hidden comment: Title_block_PPC)  (graphical)
C562  1uF  [SMD_0402]
C563  22uF  [SMD_0805]
C564  22uF  [SMD_0805]
C565  1uF  [SMD_0402]
C566  22uF  [SMD_0805]
C567  22uF  [SMD_0805]
CN1  SS-52000-01  [9 PIN PTH]
CN2  SS-52000-01  [9 PIN PTH]
FL3  DLP11SN161SL2  [SMD]
FL4  DLP11SN161SL2  [SMD]
FL5  DLP11SN161SL2  [SMD]
FL6  DLP11SN161SL2  [SMD]
FL7  DLP11SN161SL2  [SMD]
FL8  DLP11SN161SL2  [SMD]
L29  BLM18EG601SN1  [SMD_0603]
L30  BLM18EG601SN1  [SMD_0603]
R451  0  [SMD_0402]
R452  10K  [SMD_0402]
R453  10K  [SMD_0402]
R454  0  [SMD_0402]
R455  0  [SMD_0402]
U46  RCLAMP3346P.TNT  [ 7-UDFN]
U47  AP2191SG-13  [SOIC8]
U48  AP2191SG-13  [SOIC8]
U49  RCLAMP3346P.TNT  [ 7-UDFN]

### Ports
OCI1B, OCI2B, PPON1, PPON2, U2DM1, U2DM2, U2DP1, U2DP2, U3RDN1, U3RDN2, U3RXDP1, U3RXDP2, U3TXDN1, U3TXDN2, U3TXDP1, U3TXDP2

### Nets
3V3: R452.2 R453.2
5V: C562.1 C565.1 U47.2(IN) U47.3(IN) U48.2(IN) U48.3(IN)
GND: C562.2 C563.2 C564.2 C565.2 C566.2 C567.2 CN1.4(GND) CN1.7(GND_D) CN2.4(GND) CN2.7(GND_D) R451.1 R454.1 R455.1 U46.2(GND) U47.1(GND) U48.1(GND) U49.2(GND)
GND_EARTH: CN1.SHIELD CN2.SHIELD R451.2 R454.2 R455.2
VCCCH1: C566.1 C567.1 L30.1 U48.6(OUT) U48.7(OUT) U48.8(NC)
VCCCH2: C563.1 C564.1 L29.1 U47.6(OUT) U47.7(OUT) U47.8(NC)
OCI1B: R452.1 U48.5(~{OC}) ; port OCI1B
OCI2B: R453.1 U47.5(~{OC}) ; port OCI2B
PPON1: U48.4(EN) ; port PPON1
PPON2: U47.4(EN) ; port PPON2
NetC556_2: FL3.1 ; port U3TXDP2
NetC557_2: FL3.4 ; port U3TXDN2
NetC560_2: FL6.1 ; port U3TXDP1
NetC561_2: FL6.4 ; port U3TXDN1
NetCN1_1: CN1.1(VBUS) L29.2
NetCN1_2: CN1.2(D-) FL4.2 U46.4(CH3)
NetCN1_3: CN1.3(D+) FL4.3 U46.7(CH6)
NetCN1_5: CN1.5(SSRX-) FL5.3 U46.5(CH4)
NetCN1_6: CN1.6(SSRX+) FL5.2 U46.6(CH5)
NetCN1_8: CN1.8(SSTX-) FL3.3 U46.3(CH2)
NetCN1_9: CN1.9(SSTX+) FL3.2 U46.1(CH1)
NetCN2_1: CN2.1(VBUS) L30.2
NetCN2_2: CN2.2(D-) FL7.2 U49.4(CH3)
NetCN2_3: CN2.3(D+) FL7.3 U49.7(CH6)
NetCN2_5: CN2.5(SSRX-) FL8.3 U49.5(CH4)
NetCN2_6: CN2.6(SSRX+) FL8.2 U49.6(CH5)
NetCN2_8: CN2.8(SSTX-) FL6.3 U49.3(CH2)
NetCN2_9: CN2.9(SSTX+) FL6.2 U49.1(CH1)
NetFL4_1: FL4.1 ; port U2DM2
NetFL4_4: FL4.4 ; port U2DP2
NetFL5_1: FL5.1 ; port U3RXDP2
NetFL5_4: FL5.4 ; port U3RDN2
NetFL7_1: FL7.1 ; port U2DM1
NetFL7_4: FL7.4 ; port U2DP1
NetFL8_1: FL8.1 ; port U3RXDP1
NetFL8_4: FL8.4 ; port U3RDN1

### Notes on the sheet
- (near CN1) SS/CL
- (near CN2) SS/CL
- ACB_0001_0
- (in symbol USB3-StdA-R_0) Standard-A

### Library data of the parts
*#25 = Title_block_PPC: Title: T2080PCIe; Schematic Page Count: 45; Schematic Page Number: 24; Author: MICETEK; Page Create Date: March  8, 1995; Page Title: ?; Page Modify Date: *
C562 C565 = CAP NP_Dup2: CAP CER 1UF 25V X6S 0402; Manufacturer Part Number 1: GRM155C81E105KE11D; Manufacturer 1: Murata; Part Number: PASSIVE_1446; RSM: RC0402; PCB Footprint: SMD_0402; Part Type: Capacitors\Ceramic\SMD\0402
C563 C564 C566 C567 = CAP NP_Dup2: 22UF 35V 20% 0805; Manufacturer Part Number 1: C2012X5R1V226M125AC; Manufacturer 1: TDK; Part Number: PASSIVE_224; RSM: RC0805; PCB Footprint: SMD_0805; Part Type: Capacitors\Ceramic\SMD\0805
CN1 = USB3-StdA-R_0: CONN RCPT USB3.0 TYPEA 9POS R/A; Manufacturer Part Number 1: SS-52000-001; Manufacturer 1: Steward; Part Number: CONNECTORS_684; RSM: WE-USB3-692121330100; PCB Footprint: 9 PIN PTH; Distributor 1: DIGIKEY(380-1409-ND); Part Type: USB\USB30
CN2 = USB3-StdA-R_0: CONN RCPT USB3.0 TYPEA 9POS R/A; Part Number: CONNECTORS_684; Manufacturer 1: Steward; Manufacturer Part Number 1: SS-52000-001; RSM: WE-USB3-692121330100; PCB Footprint: 9 PIN PTH; Part Type: USB\USB30; Distributor 1: DIGIKEY(380-1409-ND)
FL3 = USB_CHOKE: as FL9 on sheet 18B_ETHERNET CARD; Distributor 1: DIGIKEY(490-1064-1-ND); Part Type: FILTER; PCB Footprint: SMD
FL4-FL8 = USB_CHOKE: as FL10 on sheet 18B_ETHERNET CARD; Part Type: FILTER; Distributor 1: DIGIKEY(490-1064-1-ND); PCB Footprint: SMD
L29 = FERRITE_BEAD: FERRITE BEAD 600ohm 500mA 0603 SMD; Manufacturer Part Number 1: BLM18EG601SN1 SMD; Manufacturer 1: Murata; Part Number: PASSIVE_377; RSM: RC0603; PCB Footprint: SMD_0603; Part Type: Ferrite Beads\SMD\0603
L30 = FERRITE_BEAD: FERRITE BEAD 600ohm 500mA 0603 SMD; Part Number: PASSIVE_377; Manufacturer 1: Murata; Manufacturer Part Number 1: BLM18EG601SN1 SMD; RSM: RC0603; Part Type: Ferrite Beads\SMD\0603; PCB Footprint: SMD_0603
R451 R455 = R_Dup5: RESIS.CHIP 0R 5% 0402 SMD; Part Number: PASSIVE_805; Manufacturer 1: ROYAL OHM; RSM: RC0402; Part Type: Resistors\Fixed\SMD\0402\5%; PCB Footprint: SMD_0402; Manufacturer Part Number 1: RESIS.CHIP 0R 5% 0402 SMD
R452 = R_Dup5: RESIS.CHIP 10K 1% 0402 SMD; Part Number: PASSIVE_584; Manufacturer 1: ROYAL OHM; RSM: RC0402; Part Type: Resistors\Fixed\SMD\0402\1%; Manufacturer Part Number 1: RESIS.CHIP 10K 1% 0402 SMD; PCB Footprint: SMD_0402
R453 = R_Dup5: RESIS.CHIP 10K 1% 0402 SMD; Manufacturer 1: ROYAL OHM; Part Number: PASSIVE_584; RSM: RC0402; Manufacturer Part Number 1: RESIS.CHIP 10K 1% 0402 SMD; PCB Footprint: SMD_0402; Part Type: Resistors\Fixed\SMD\0402\1%
R454 = R_Dup5: as R456 on sheet 18B_ETHERNET CARD; PCB Footprint: SMD_0402; Manufacturer Part Number 1: RESIS.CHIP 0R 5% 0402 SMD; Part Type: Resistors\Fixed\SMD\0402\5%
U46 U49 = PUSB3AB6: High speed ESD protection LOW CAPACITANCE; Part Number: DISCRETE_290; Manufacturer 1: Semtech; PCB Footprint: 7-UDFN; Part Type: Protections; Manufacturer Part Number 1: RCLAMP3346P.TNT; Distributor 1: DIGIKEY(RCLAMP3346P.TNTCT-ND); RSM: RCLAMP3346P
U47 U48 = RT9715CGBR_2: usb distribuzione alimentazione 1.5A 2.7V-5.5V; Part Number: LOGIC_353; Manufacturer 1: DIODES; RSM: SO-8; Part Type: USB\SWITCH; Manufacturer Part Number 1: AP2191SG-13; Distributor 1: MOUSER(621-AP2191SG-13); PCB Footprint: SOIC8

## Sheet 19B WLAN_CONNECTOR.SchDoc
size 420 x 297 mm
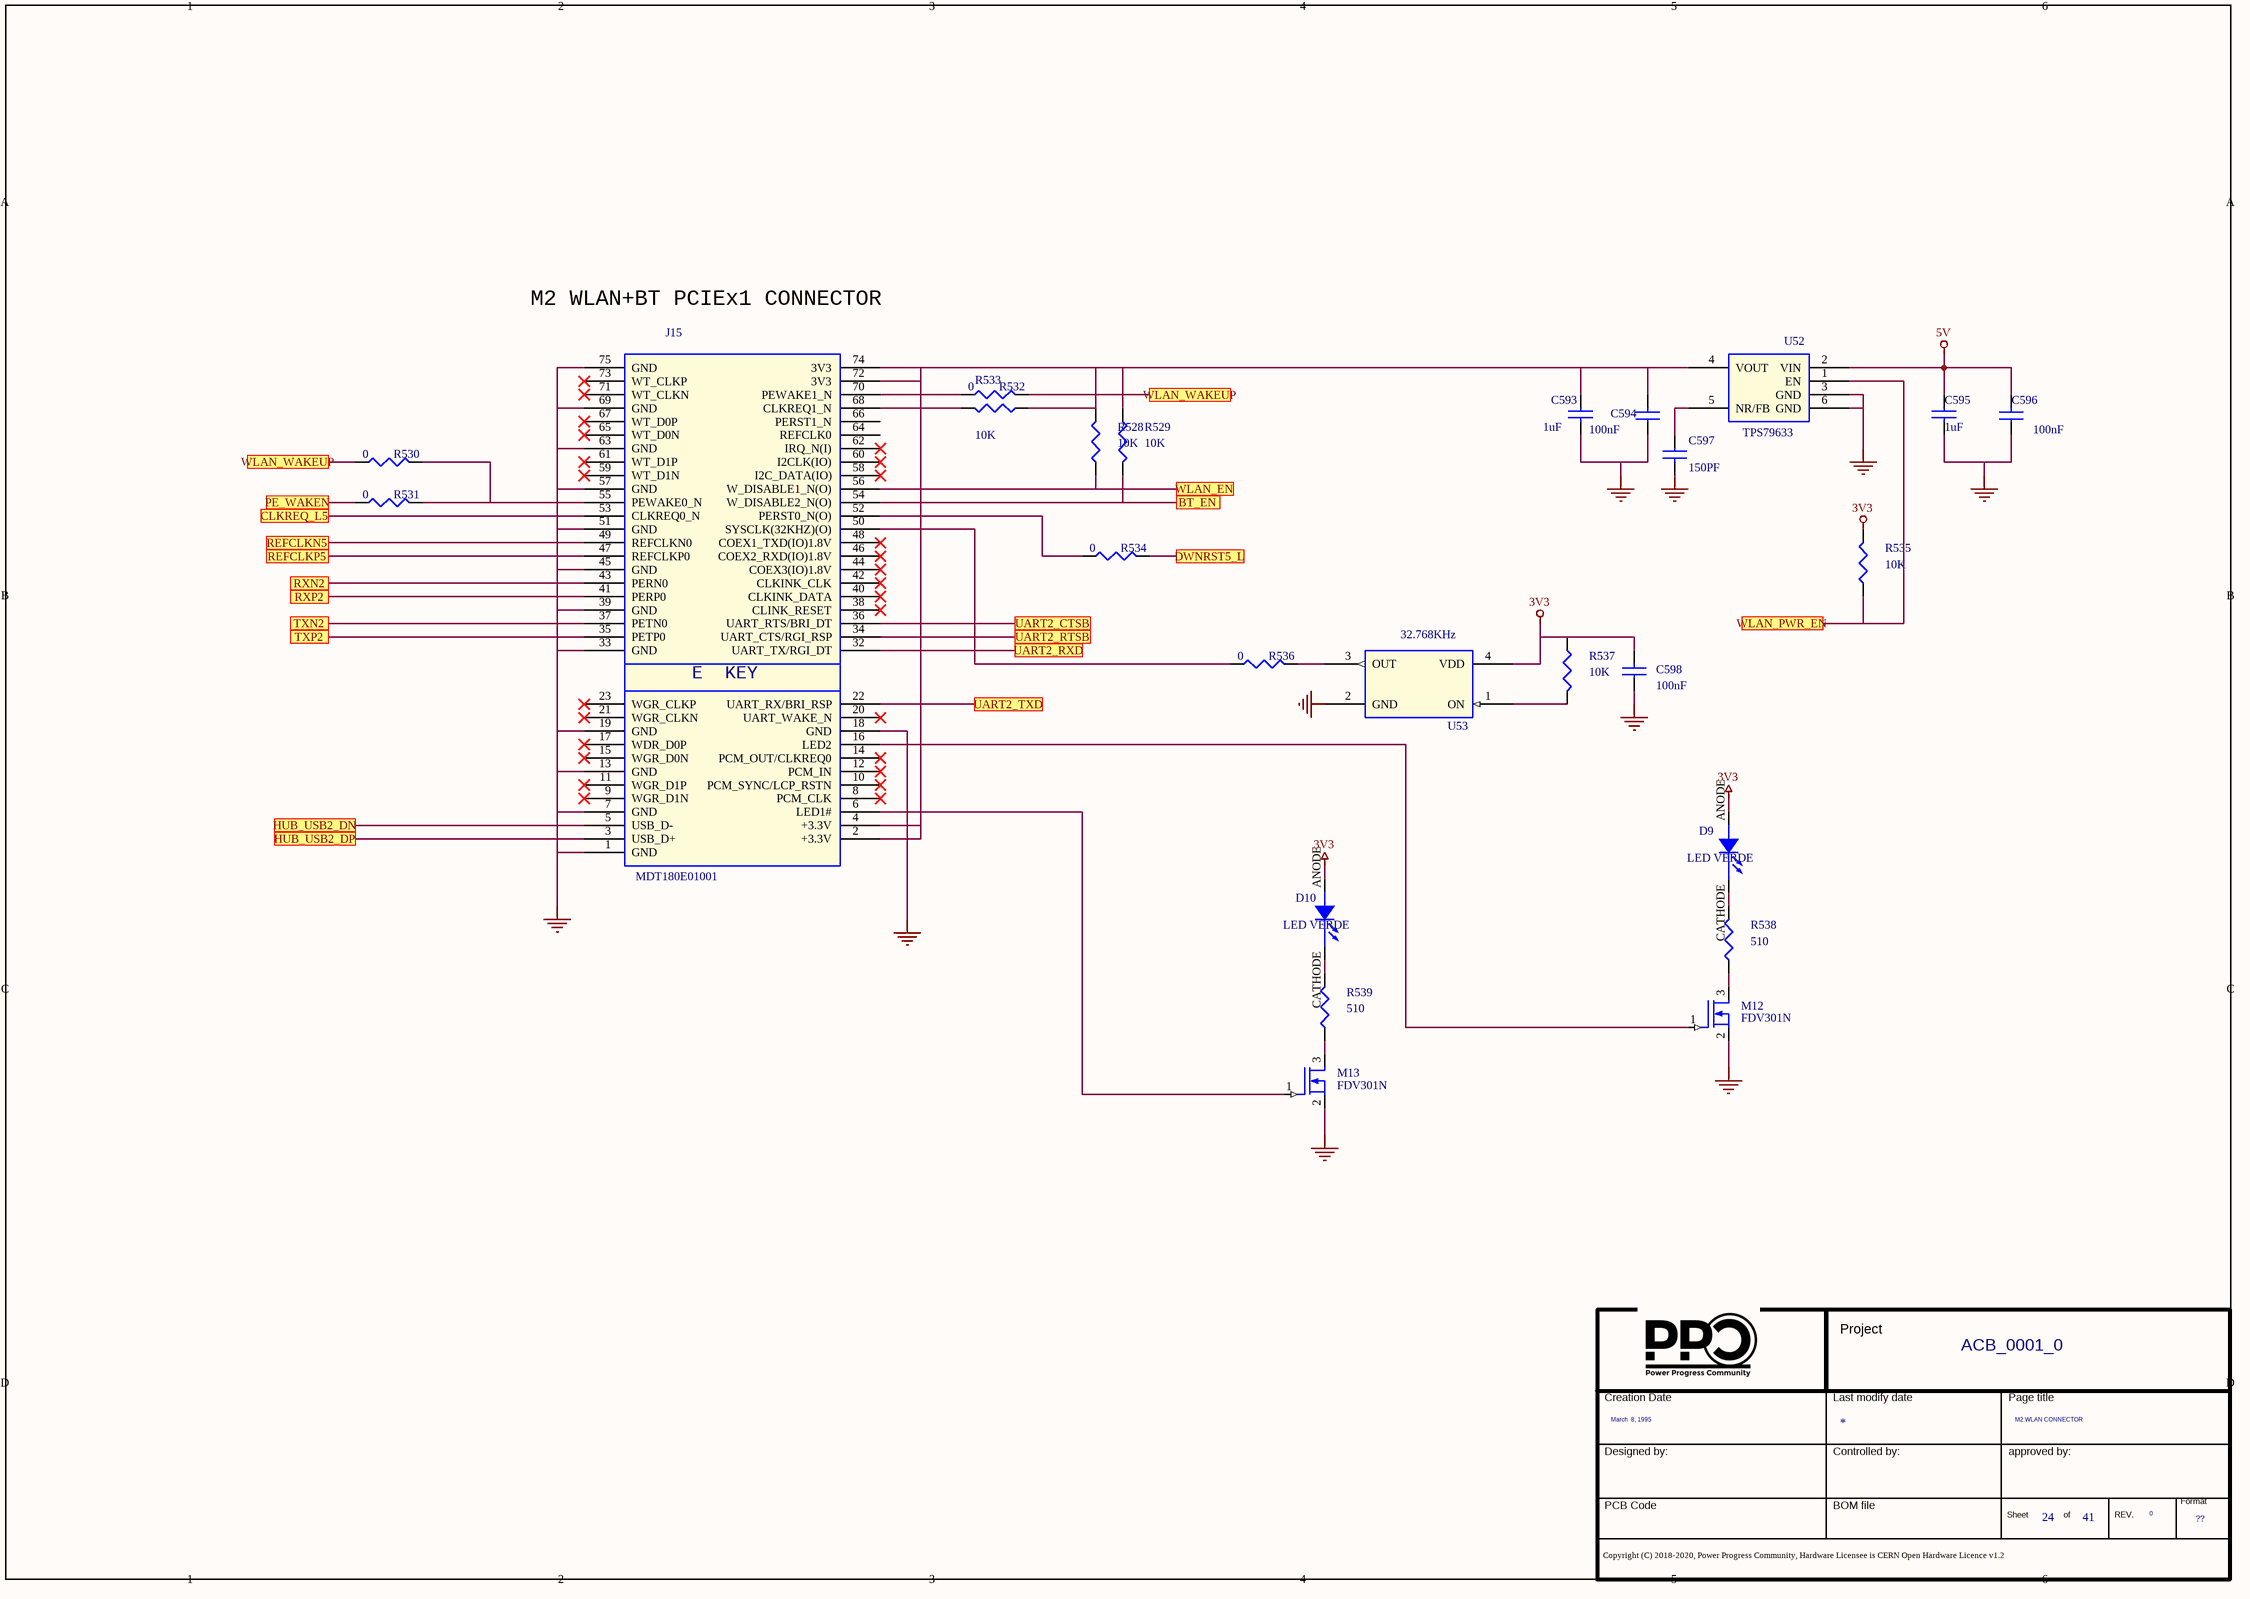
[diagram p39: 19B WLAN_CONNECTOR.SchDoc]

### Parts
(Parts that share a designator on the sheet are numbered #1, #2 ... from top to bottom, then left to right.)
*#26  Page Count: 41  Page Create Date: March  8, 1995  Page Number: 24  Page Size: ??  Page Title: M2.WLAN CONNECTOR  RevCode: 0  Title: ACB_0001_0  (hidden comment: Title_block_PPC)  (graphical)
C593  1uF  [SMD_0402]
C594  100nF  [SMD_0402]
C595  1uF  [SMD_0402]
C596  100nF  [SMD_0402]
C597  150PF  [SMD_0402]
C598  100nF  [SMD_0402]
D9  LED VERDE  [led_0603]
D10  LED VERDE  [led_0603]
J15  MDT180E01001  [67 PIN PASSO 0.5mm]
M12  FDV301N  [sot23]
M13  FDV301N  [sot23]
R528  10K  [SMD_0402]
R529  10K  [SMD_0402]
R530  0  [SMD_0402]
R531  0  [SMD_0402]
R532  0  [SMD_0402]
R533  10K  [SMD_0402]
R534  0  [SMD_0402]
R535  10K  [SMD_0402]
R536  0  [SMD_0402]
R537  10K  [SMD_0402]
R538  510  [SMD_0402]
R539  510  [SMD_0402]
U52  TPS79633  [SOT223-6]
U53  32.768KHz  [4 PIN SMT]

### Ports
BT_EN, CLKREQ_L5, DWNRST5_L, HUB_USB2_DN, HUB_USB2_DP, PE_WAKEN, REFCLKN5, REFCLKP5, RXN2, RXP2, TXN2, TXP2, UART2_CTSB, UART2_RTSB, UART2_RXD, UART2_TXD, WLAN_EN, WLAN_PWR_EN, WLAN_WAKEUP

### Nets
3V3: C598.2 D9.ANODE D10.ANODE R535.1 R537.1 U53.4(VDD)
5V: C595.1 C596.2 U52.2(VIN)
GND: C593.2 C594.1 C595.2 C596.1 C597.2 C598.1 J15.1(GND) J15.7(GND) J15.13(GND) J15.18(GND) J15.19(GND) J15.33(GND) J15.39(GND) J15.45(GND) J15.51(GND) J15.57(GND) J15.63(GND) J15.69(GND) J15.75(GND) M12.2(SOURCE) M13.2(SOURCE) U52.3(GND) U52.6(GND) U53.2(GND)
CLKREQ_L5: J15.53(CLKREQ0_N) ; port CLKREQ_L5
DWNRST5_L: R534.1 ; port DWNRST5_L
HUB_USB2_DN: J15.5(USB_D-) ; port HUB_USB2_DN
HUB_USB2_DP: J15.3(USB_D+) ; port HUB_USB2_DP
RXN2: J15.43(PERN0) ; port RXN2
RXP2: J15.41(PERP0) ; port RXP2
TXN2: J15.37(PETN0) ; port TXN2
TXP2: J15.35(PETP0) ; port TXP2
NetC593_1: C593.1 C594.2 J15.2(+3.3V) J15.4(+3.3V) J15.72(3V3) J15.74(3V3) R528.1 R529.1 R533.2 U52.4(VOUT)
NetC597_1: C597.1 U52.5(NR/FB)
NetD9_CATHODE: D9.CATHODE R538.1
NetD10_CATHODE: D10.CATHODE R539.1
NetJ15_6: J15.6(LED1#) M13.1(GATE)
NetJ15_16: J15.16(LED2) M12.1(GATE)
NetJ15_22: J15.22(UART_RX/BRI_RSP) ; port UART2_TXD
NetJ15_32: J15.32(UART_TX/RGI_DT) ; port UART2_RXD
NetJ15_34: J15.34(UART_CTS/RGI_RSP) ; port UART2_RTSB
NetJ15_36: J15.36(UART_RTS/BRI_DT) ; port UART2_CTSB
NetJ15_47: J15.47(REFCLKP0) ; port REFCLKP5
NetJ15_49: J15.49(REFCLKN0) ; port REFCLKN5
NetJ15_50: J15.50(SYSCLK(32KHZ)(O)) R536.2
NetJ15_52: J15.52(PERST0_N(O)) R534.2
NetJ15_54: J15.54(W_DISABLE2_N(O)) R529.2 ; port BT_EN
NetJ15_55: J15.55(PEWAKE0_N) R530.1 R531.1
NetJ15_56: J15.56(W_DISABLE1_N(O)) R528.2 ; port WLAN_EN
NetJ15_68: J15.68(CLKREQ1_N) R533.1
NetJ15_70: J15.70(PEWAKE1_N) R532.2
NetM12_3: M12.3(DRAIN) R538.2
NetM13_3: M13.3(DRAIN) R539.2
NetR290_2: R531.2 ; port PE_WAKEN
NetR291_2: R530.2 R532.1 ; port WLAN_WAKEUP
NetR354_2: R535.2 U52.1(EN) ; port WLAN_PWR_EN
NetR536_1: R536.1 U53.3(OUT)
NetR537_2: R537.2 U53.1(ON)

Not connected (* = marked no-connect by the designer): J15 8(PCM_CLK)* 9(WGR_D1N)* 10(PCM_SYNC/LCP_RSTN)* 11(WGR_D1P)* 12(PCM_IN)* 14(PCM_OUT/CLKREQ0)* 15(WGR_D0N)* 17(WDR_D0P)* 20(UART_WAKE_N)* 21(WGR_CLKN)* 23(WGR_CLKP)* 38(CLINK_RESET)* 40(CLKINK_DATA)* 42(CLKINK_CLK)* 44(COEX3(IO)1.8V)* 46(COEX2_RXD(IO)1.8V)* 48(COEX1_TXD(IO)1.8V)* 58(I2C_DATA(IO))* 59(WT_D1N)* 60(I2CLK(IO))* 61(WT_D1P)* 62(IRQ_N(I))* 64(REFCLK0) 65(WT_D0N)* 66(PERST1_N) 67(WT_D0P)* 71(WT_CLKN)* 73(WT_CLKP)*

### Notes on the sheet
- M2 WLAN+BT PCIEx1 CONNECTOR
- (in symbol M2_E_KEY) E  KEY

### Library data of the parts
*#26 = Title_block_PPC: Schematic Page Count: 45; Schematic Page Number: 27; Page Modify Date: *
C593 = CAP NP_Dup9: CAP CER 1UF 6.3V 10% X5R 0402 AUTOMOTIVE; Part Number: PASSIVE_49; Manufacturer 1: Taiyo Yuden; Manufacturer Part Number 1: JMK105BJ105KVHF; RSM: RC0402; Part Type: Capacitors\Ceramic\SMD\0402; Distributor 1: DIGIKEY (587-3766-1-ND); PCB Footprint: SMD_0402
C594 C598 = CAP NP_Dup9: COND.CER. 100NF 50V 0402 X7R SMD; Manufacturer Part Number 1: CGA2B3X7R1H104M050BD; Manufacturer 1: TDK; Part Number: PASSIVE_24; RSM: RC0402; Distributor 1: MURATA ELETTRONICA SPA; Part Type: Capacitors\Ceramic\SMD\0402; PCB Footprint: SMD_0402
C595 = CAP NP_Dup9: CAP CER 1UF 6.3V 10% X5R 0402 AUTOMOTIVE; Manufacturer Part Number 1: JMK105BJ105KVHF; Manufacturer 1: Taiyo Yuden; Part Number: PASSIVE_49; RSM: RC0402; Distributor 1: DIGIKEY (587-3766-1-ND); Part Type: Capacitors\Ceramic\SMD\0402; PCB Footprint: SMD_0402
C596 = CAP NP_Dup9: COND.CER. 100NF 50V 0402 X7R SMD; Part Number: PASSIVE_24; Manufacturer 1: TDK; Manufacturer Part Number 1: CGA2B3X7R1H104M050BD; RSM: RC0402; Part Type: Capacitors\Ceramic\SMD\0402; Distributor 1: MURATA ELETTRONICA SPA; PCB Footprint: SMD_0402
C597 = CAP NP_Dup9: COND.CER. 150PF 50V 0402 5% COG SMD; Part Number: PASSIVE_39; Manufacturer 1: Murata; Manufacturer Part Number 1: GRM1555C1H151JD01D; RSM: RC0402; Part Type: Capacitors\Ceramic\SMD\0402; Distributor 1: MURATA ELETTRONICA SPA; PCB Footprint: SMD_0402
D9 D10 = LED_1: LED CHIPLED VERDE 40mcd 570nm; Part Number: DISCRETE_31; Manufacturer 1: DIALIGHT; Manufacturer Part Number 1: 598-8070-107F; PCB Footprint: SMD_0603; RSM: LED0603-AK; TYPE: LED; Part Type: Diodes\LED; Distributor 1: MOUSER(645-598-8070-107F)
J15 = M2_E_KEY: Connettori PCI Express/PCI 67P SMT RCPT H1.8 E Key; Part Number: CONNECTORS_680; Manufacturer 1: AMPHENOL; RSM: FCI-MDT180M01001; PCB Footprint: 67 PIN PASSO 0.5mm; Part Type: CON_M2; Manufacturer Part Number 1: MDT180E01001; Distributor 1: MOUSER(523-MDT180E01001)
M12 M13 = NMOS_SOT23: FDV301N N CHANNEL DIGITAL FET; Manufacturer Part Number 1: FDV301N  (ROHS COMPLIANT); Manufacturer 1: FAIRCHILD; Part Number: DISCRETE_196; RSM: SOT-23; Distributor 1: CLAITRON LASI SILVESTAR S.R.L; Part Type: Mosfet\SOT23; PCB Footprint: sot23
R528 R529 R533 R535 R537 = R_Dup5: as R453 on sheet 18 USB3_ports; Manufacturer Part Number 1: RESIS.CHIP 10K 1% 0402 SMD; PCB Footprint: SMD_0402; Part Type: Resistors\Fixed\SMD\0402\1%
R530 R531 = R_Dup8: RESIS.CHIP 0R 5% 0402 SMD; Part Number: PASSIVE_805; Manufacturer 1: ROYAL OHM; RSM: RC0402; Part Type: Resistors\Fixed\SMD\0402\5%; Manufacturer Part Number 1: RESIS.CHIP 0R 5% 0402 SMD; Distributor 1: CAMEL ELETTRONICA SRL  #; PCB Footprint: SMD_0402
R532 R534 R536 = R_Dup8: RESIS.CHIP 0R 5% 0402 SMD; Manufacturer 1: ROYAL OHM; Part Number: PASSIVE_805; RSM: RC0402; Distributor 1: CAMEL ELETTRONICA SRL  #; Manufacturer Part Number 1: RESIS.CHIP 0R 5% 0402 SMD; Part Type: Resistors\Fixed\SMD\0402\5%; PCB Footprint: SMD_0402
R538 R539 = R_Dup5: RESIS.CHIP 510R 1% 0402 SMD; Manufacturer 1: ROYAL OHM; Part Number: PASSIVE_749; RSM: RC0402; Manufacturer Part Number 1: RESIS.CHIP 510R 1% 0402 SMD; Part Type: Resistors\Fixed\SMD\0402\1%; PCB Footprint: SMD_0402
U52 = TPS79633: IC REG LDO 3.3V 1A SOT223-6; Manufacturer Part Number 1: TPS79633DCQR; Manufacturer 1: TEXAS; Part Number: LINEAR_142; RSM: SOT-223-6; Distributor 1: DIGIKEY(296-13766-1-ND); Part Type: Regulators\LDO; PCB Footprint: SOT223-6
U53 = OSCILLATOR: Oscillator 32.768kHZ 25ppm 1.8V SMD 3225; Manufacturer Part Number 1: TC32M5I32K7680; Manufacturer 1: CTS; Part Number: MISC_92; PCB Footprint: SMD_3.2x2.5; RSM: TSSOP-14; Distributor 1: DIGIKEY(CTX1181CT-ND); Part Type: Oscillator